# Altium project 724452_RPL-HX_Mobile_AEP_Rev0p91.PrjPcb (part 11 of 13)

## Sheet 0083_USB3.SchDoc
size 848 x 558 mm
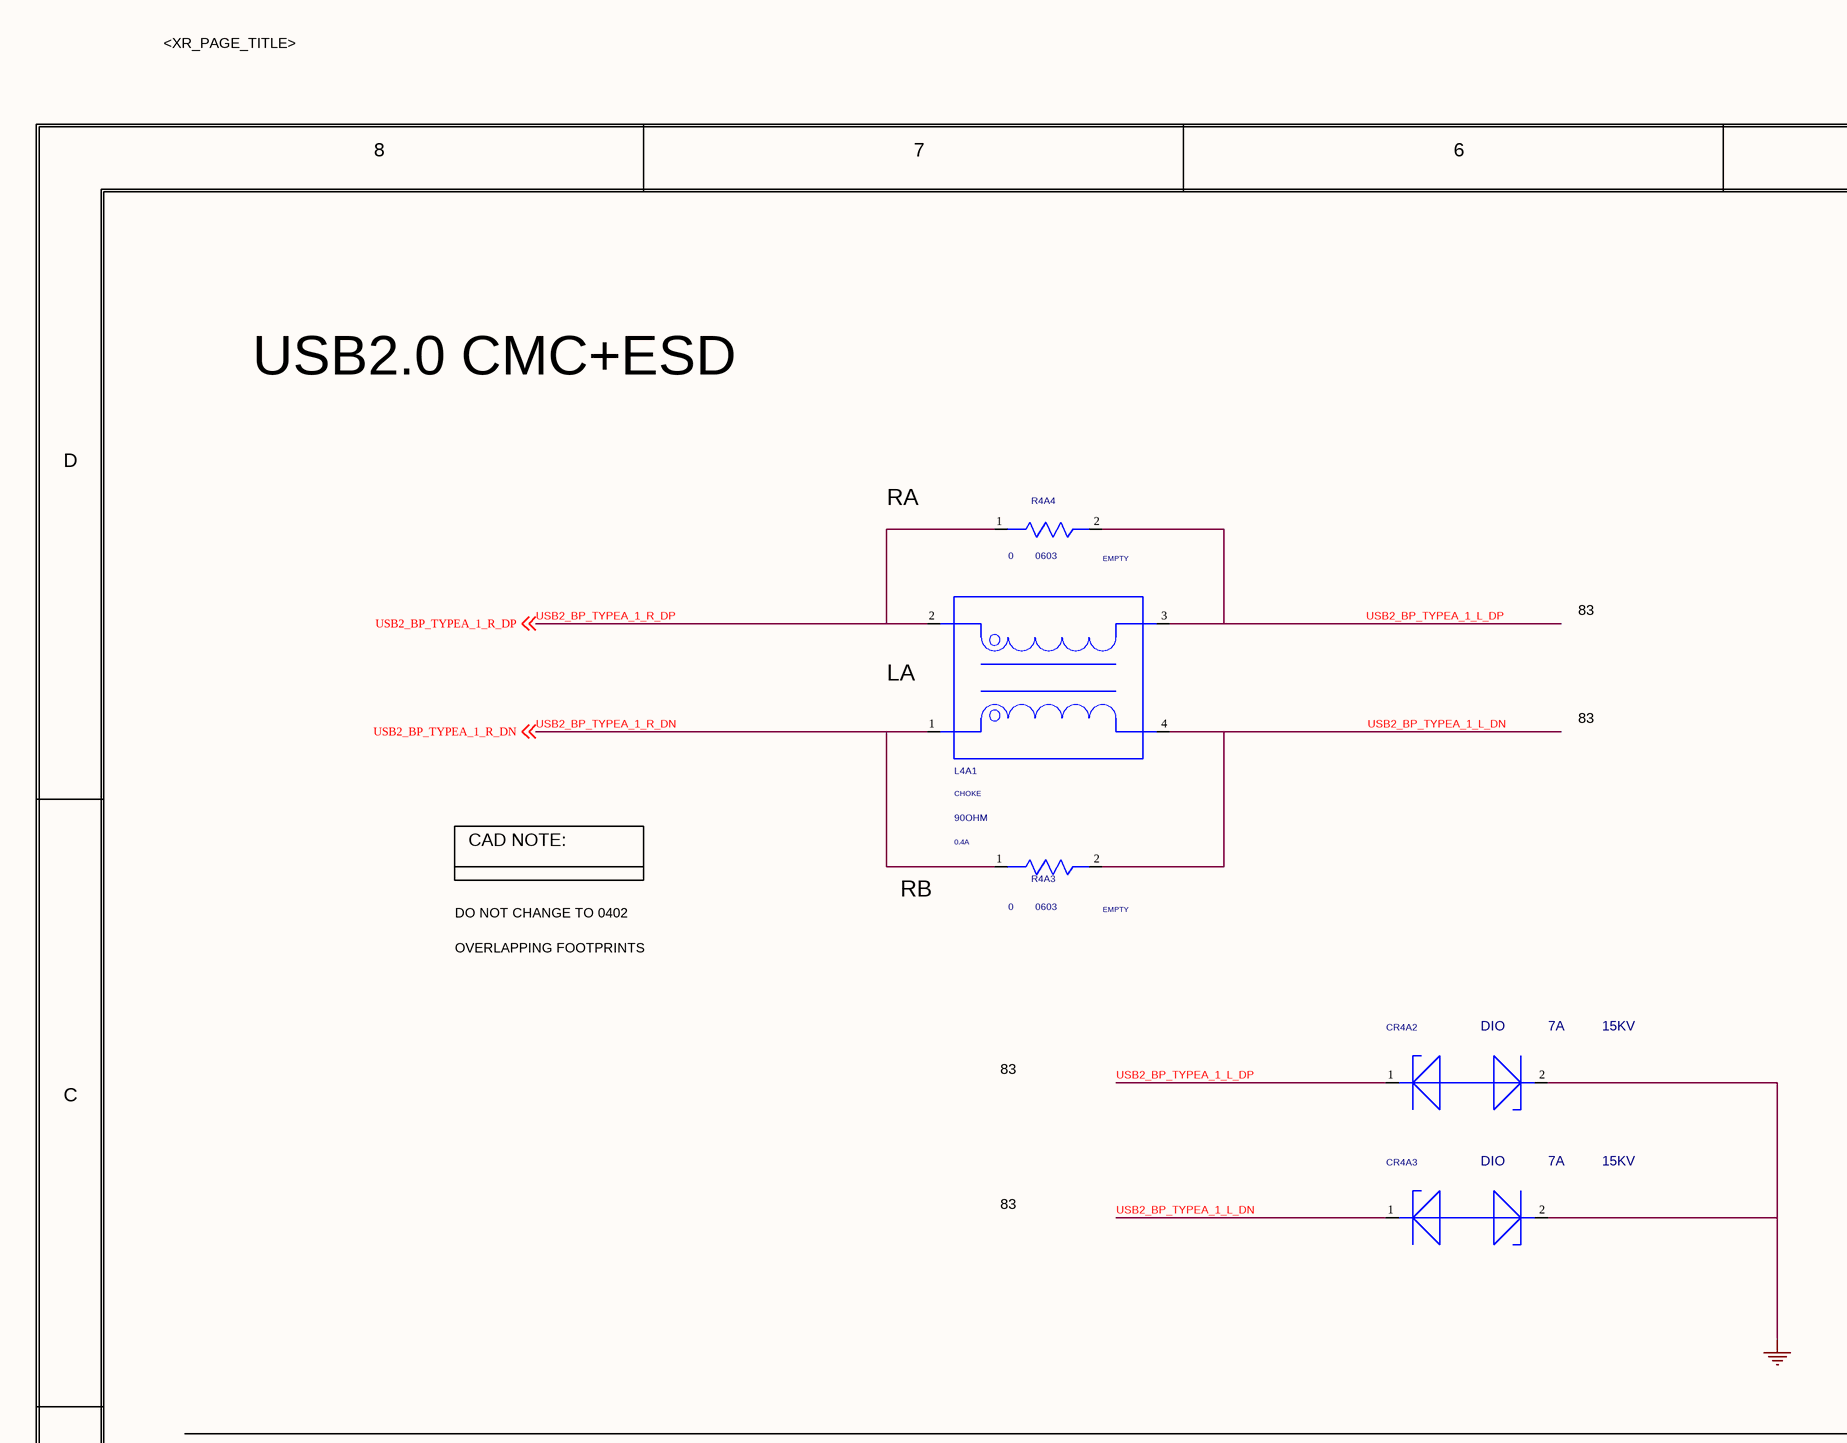
[diagram p136: 0083_USB3.SchDoc, top left]
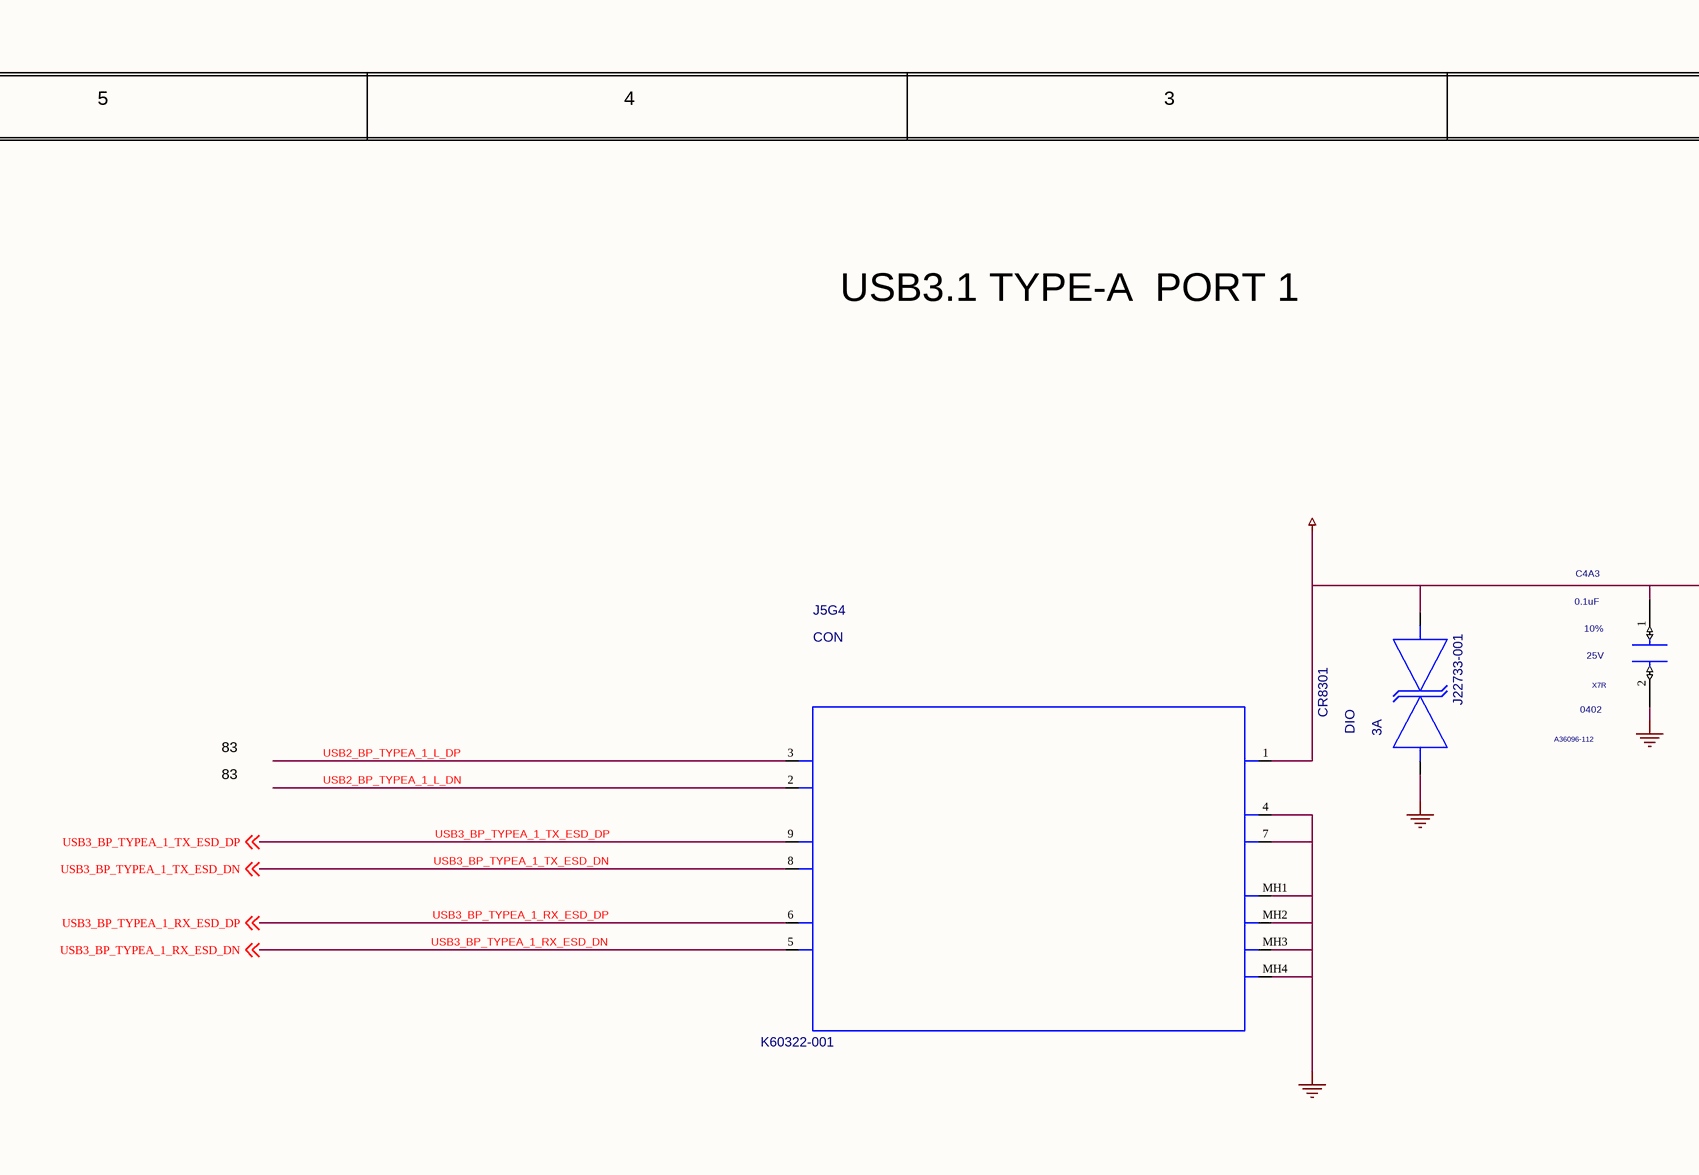
[diagram p137: 0083_USB3.SchDoc, top middle]
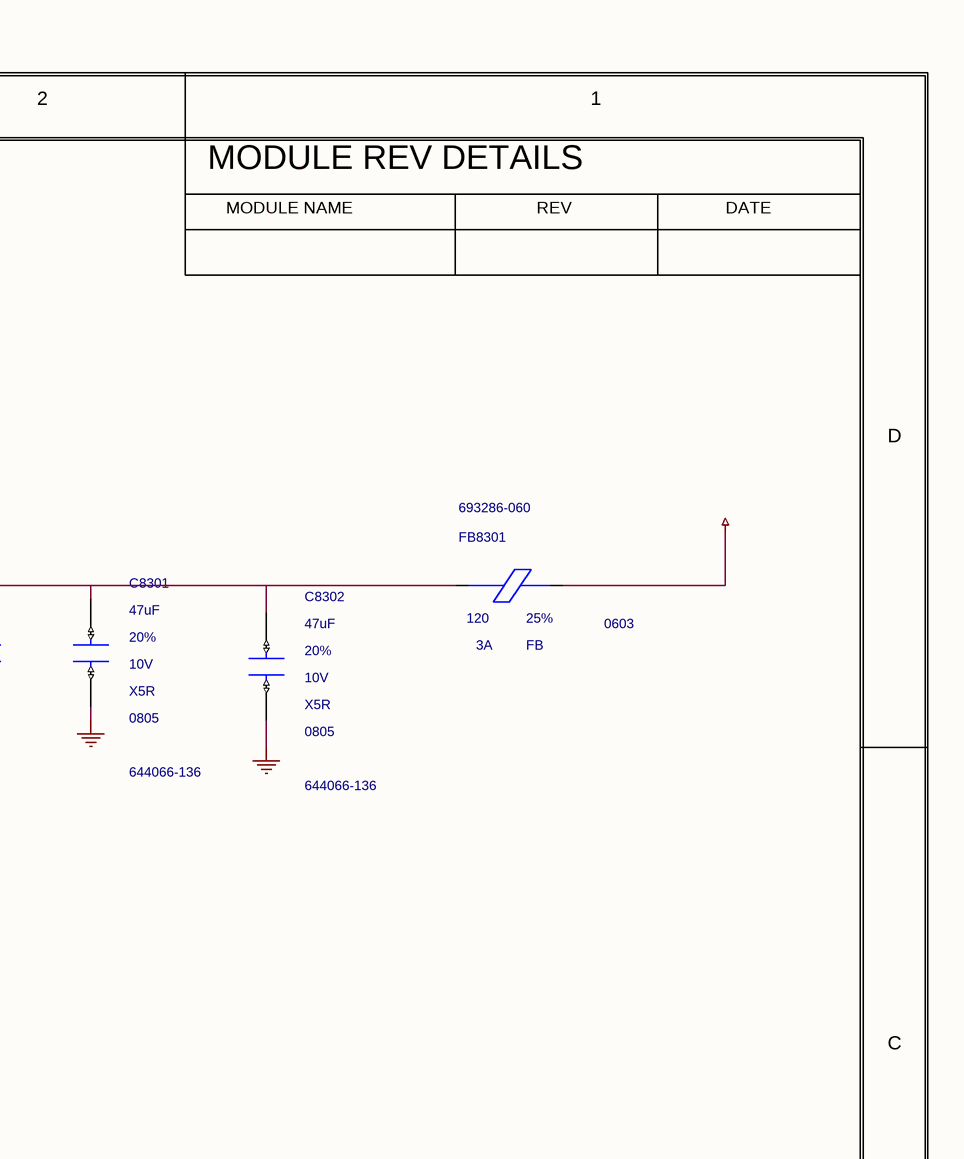
[diagram p138: 0083_USB3.SchDoc, top right]
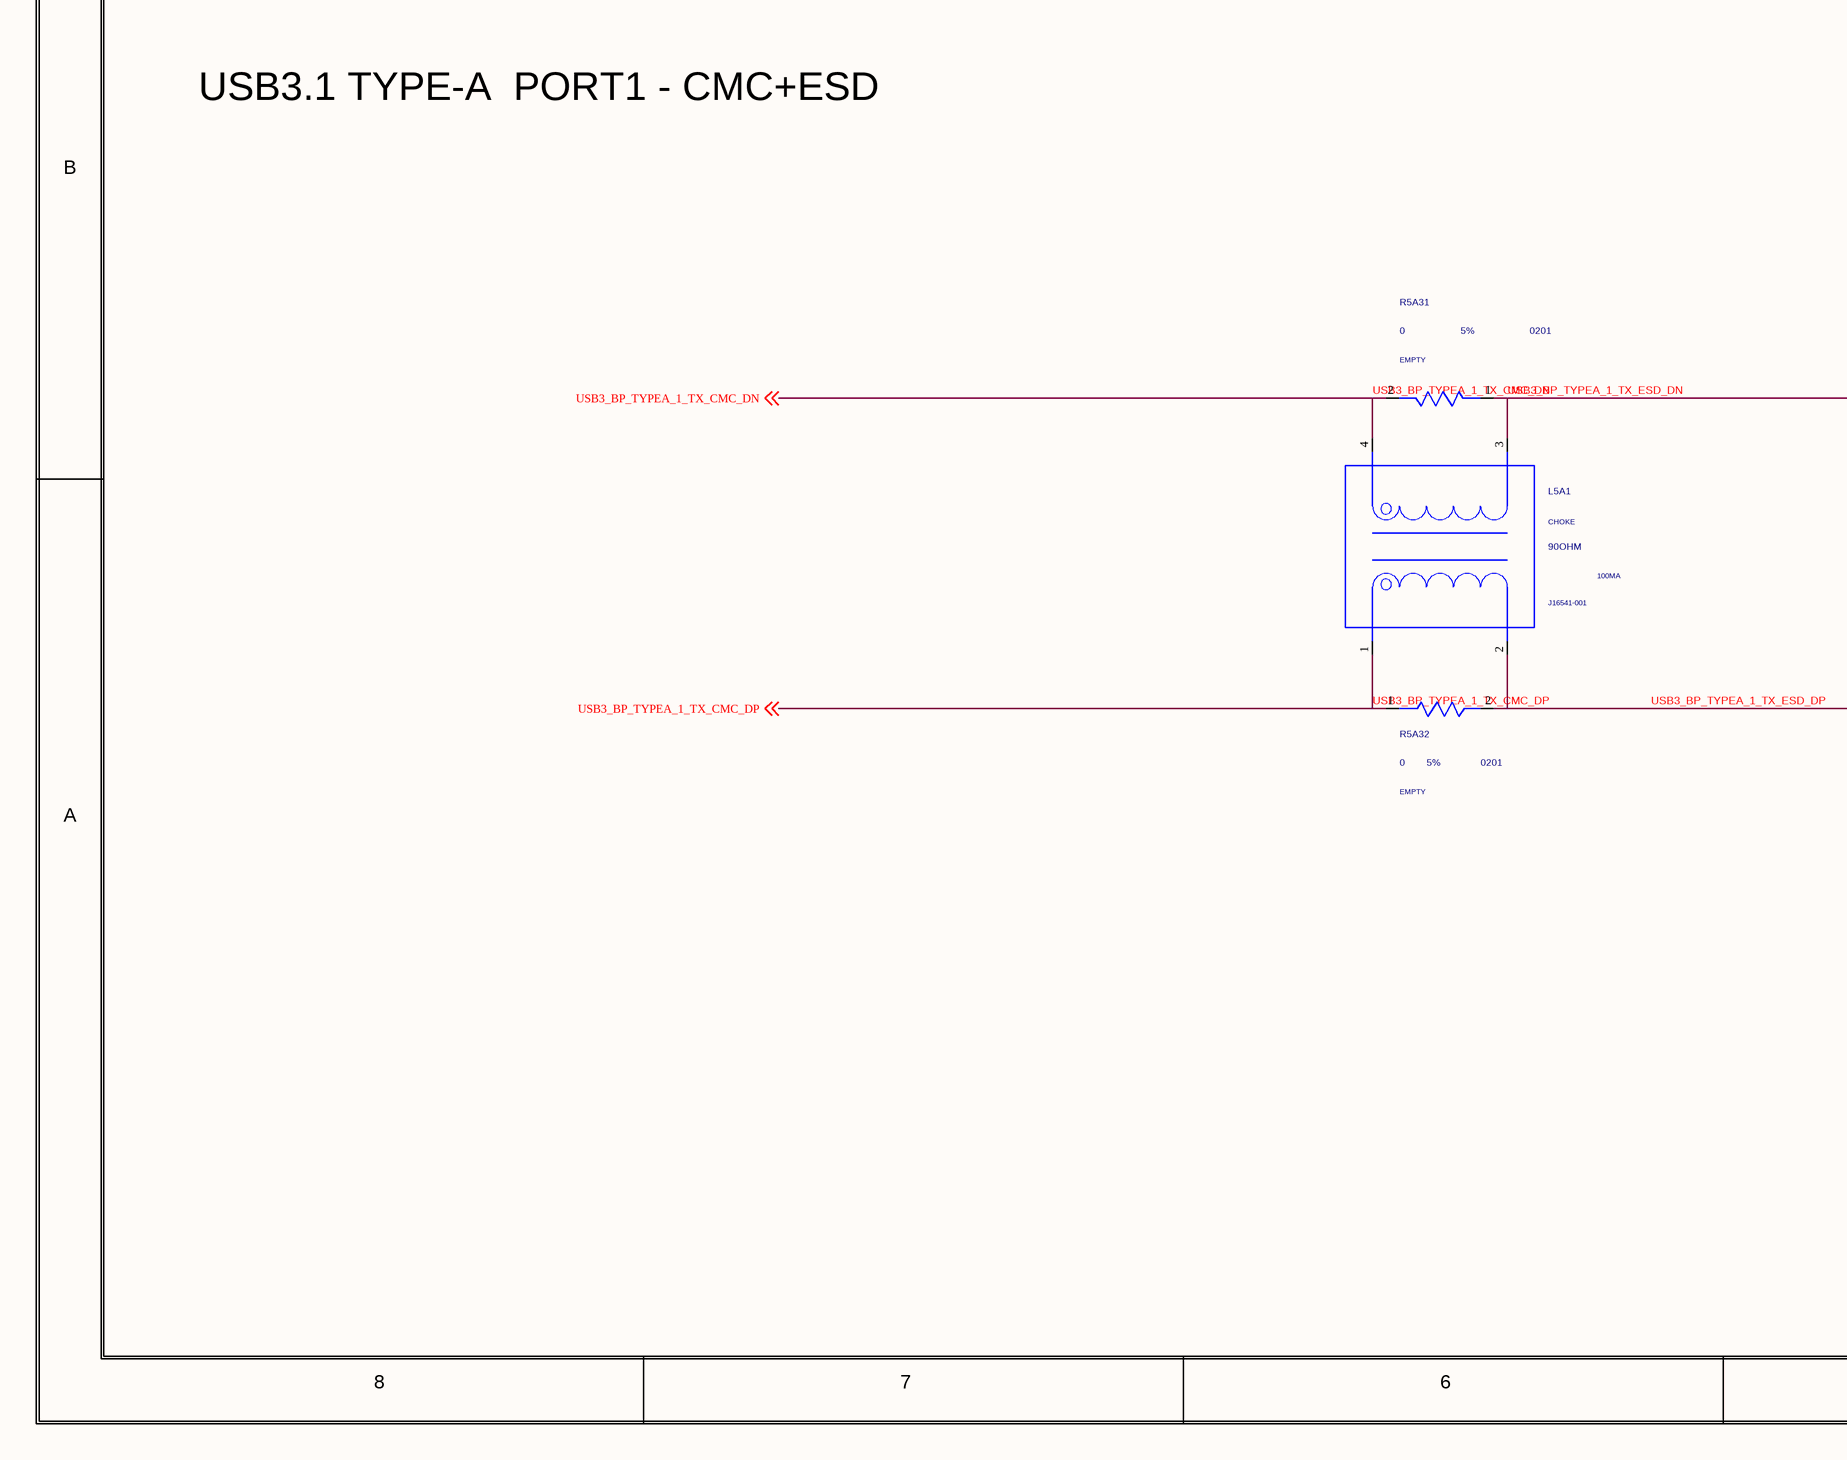
[diagram p139: 0083_USB3.SchDoc, bottom left]
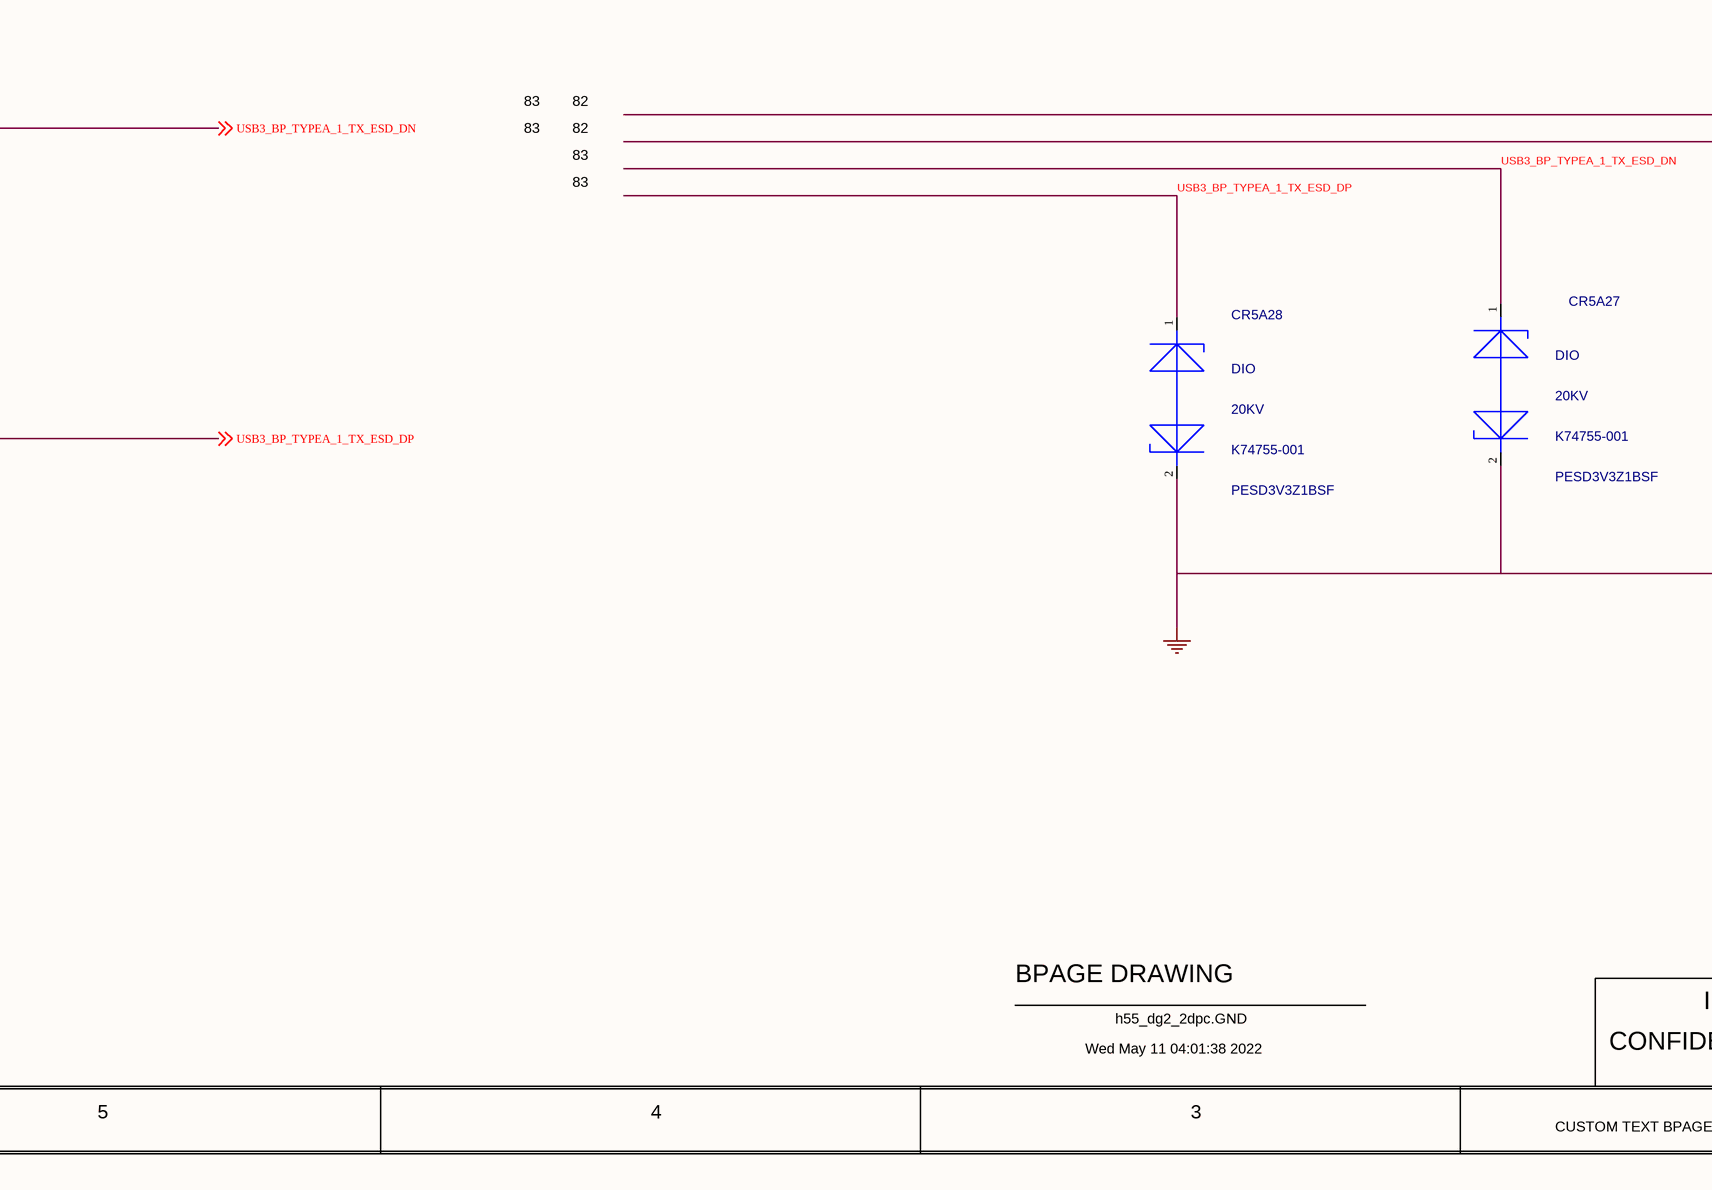
[diagram p140: 0083_USB3.SchDoc, bottom middle]
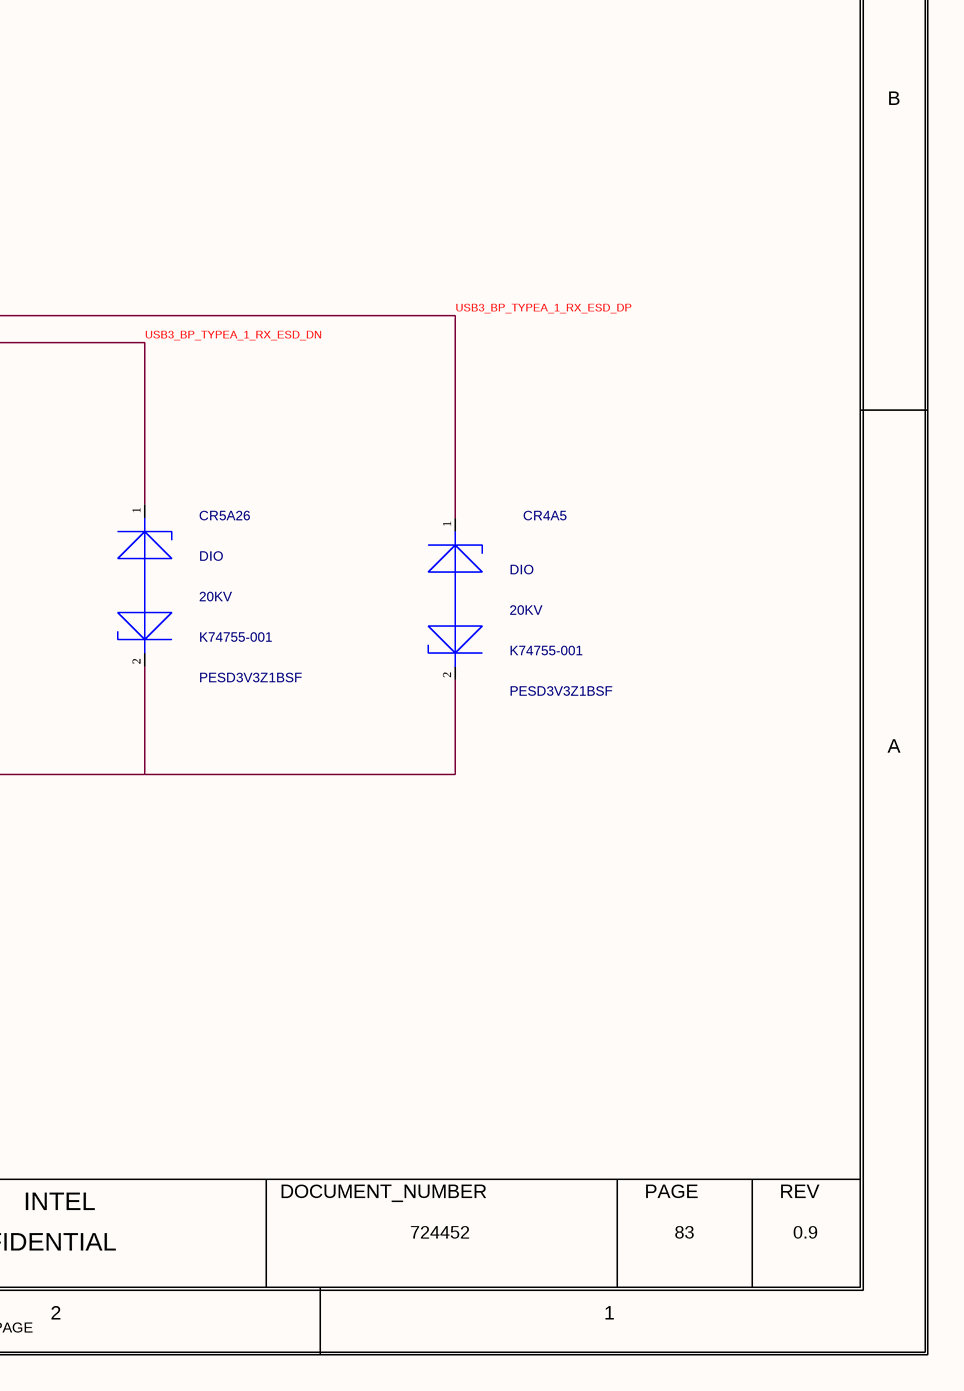
[diagram p141: 0083_USB3.SchDoc, bottom right]

### Parts
C4A3  0.1uF  MATERIAL: X7R  PACK_TYPE: 0402  PART_NUMBER: A36096-112  TOLERANCE: 10%  VOLTAGE: 25V  [SMC0402IA]
C8301  47uF  MATERIAL: X5R  PACK_TYPE: 0805  PART_NUMBER: 644066-136  TOLERANCE: 20%  VOLTAGE: 10V  [CTK2_SM0805_2200X1450_MA]
C8302  47uF  MATERIAL: X5R  PACK_TYPE: 0805  PART_NUMBER: 644066-136  TOLERANCE: 20%  VOLTAGE: 10V  [CTK2_SM0805_2200X1450_MA]
CR4A2  15KV  CURRENT: 7A  MATERIAL: DIO  [TK0_SOD962_600X300_MA]
CR4A3  15KV  CURRENT: 7A  MATERIAL: DIO  [TK0_SOD962_600X300_MA]
CR4A5  PESD3V3Z1BSF  CURRENT: 20KV  MATERIAL: DIO  PART_NUMBER: K74755-001  [TK0_SCR_625X325_MB]
CR5A26  PESD3V3Z1BSF  CURRENT: 20KV  MATERIAL: DIO  PART_NUMBER: K74755-001  [TK0_SCR_625X325_MB]
CR5A27  PESD3V3Z1BSF  CURRENT: 20KV  MATERIAL: DIO  PART_NUMBER: K74755-001  [TK0_SCR_625X325_MB]
CR5A28  PESD3V3Z1BSF  CURRENT: 20KV  MATERIAL: DIO  PART_NUMBER: K74755-001  [TK0_SCR_625X325_MB]
CR8301  CURRENT: 3A  MATERIAL: DIO  PART_NUMBER: J22733-001  [CTK2_SCR0201_610X310_MA]  (hidden comment: ESD200-B1-CSP0201)
FB8301  120  CURRENT: 3A  MATERIAL: FB  PACK_TYPE: 0603  PART_NUMBER: 693286-060  TOLERANCE: 25%  [CTK2_SM0603_1750X950_MA]
J5G4  MATERIAL: CON  PART_NUMBER: K60322-001  [CUSB3_MIDJR_9P_4EM_2000_MA_PIP_MR]  (hidden comment: C_USB3_TYPE_A_9P_4EM)
L4A1  90OHM  CURRENT: 0.4A  MATERIAL: CHOKE  [SMI4_79X47IA]
L5A1  90OHM  CURRENT: 100MA  MATERIAL: CHOKE  PART_NUMBER: J16541-001  [SMI4_50X65MA]
R4A3  0  MATERIAL: EMPTY  PACK_TYPE: 0603  [SMR0603IA]
R4A4  0  MATERIAL: EMPTY  PACK_TYPE: 0603  [SMR0603IA]
R5A31  0  MATERIAL: EMPTY  PACK_TYPE: 0201  TOLERANCE: 5%  [SMR0201IA]
R5A32  0  MATERIAL: EMPTY  PACK_TYPE: 0201  TOLERANCE: 5%  [SMR0201IA]

### Nets
+V5A_USB_P1: FB8301.2(B)
+V5A_USB_P1_FB: C4A3.1(A) C8301.1(A) C8302.1(A) CR8301.2(A2) FB8301.1(A) J5G4.1(VBUS_POWER)
GND: C4A3.2(B) C8301.2(B) C8302.2(B) CR4A2.2(K2) CR4A3.2(K2) CR4A5.2(K2) CR5A26.2(K2) CR5A27.2(K2) CR5A28.2(K2) CR8301.1(A1) J5G4.4(GND_POWER_RETURN) J5G4.7(GND) J5G4.MH1 J5G4.MH2 J5G4.MH3 J5G4.MH4  [project net EXP_A_RX_4_DP]
USB2_BP_TYPEA_1_L_DN: CR4A3.1(K1) J5G4.2(D_DN) L4A1.4(OUT_1) R4A3.2(B)
USB2_BP_TYPEA_1_L_DP: CR4A2.1(K1) J5G4.3(D_DP) L4A1.3(IN_2) R4A4.2(B)
USB2_BP_TYPEA_1_R_DN: L4A1.1(IN_1) R4A3.1(A) ; off-sheet USB2_BP_TYPEA_1_R_DN
USB2_BP_TYPEA_1_R_DP: L4A1.2(OUT_2) R4A4.1(A) ; off-sheet USB2_BP_TYPEA_1_R_DP
USB3_BP_TYPEA_1_RX_ESD_DN: CR5A26.1(K1) J5G4.5(SSRX_DN) ; off-sheet USB3_BP_TYPEA_1_RX_ESD_DN
USB3_BP_TYPEA_1_RX_ESD_DP: CR4A5.1(K1) J5G4.6(SSRX_DP) ; off-sheet USB3_BP_TYPEA_1_RX_ESD_DP
USB3_BP_TYPEA_1_TX_CMC_DN: L5A1.4(PIN4) R5A31.2(B) ; off-sheet USB3_BP_TYPEA_1_TX_CMC_DN
USB3_BP_TYPEA_1_TX_CMC_DP: L5A1.1(PIN1) R5A32.1(A) ; off-sheet USB3_BP_TYPEA_1_TX_CMC_DP
USB3_BP_TYPEA_1_TX_ESD_DN: CR5A27.1(K1) J5G4.8(SSTX_DN) L5A1.3(PIN3) R5A31.1(A) ; off-sheet USB3_BP_TYPEA_1_TX_ESD_DN
USB3_BP_TYPEA_1_TX_ESD_DP: CR5A28.1(K1) J5G4.9(SSTX_DP) L5A1.2(PIN2) R5A32.2(B) ; off-sheet USB3_BP_TYPEA_1_TX_ESD_DP

### Notes on the sheet
- <XR_PAGE_TITLE>
- 8
- 7
- 6
- 5
- 4
- 3
- 2
- 1
- MODULE REV DETAILS
- MODULE NAME
- REV
- DATE
- USB2.0 CMC+ESD
- USB3.1 TYPE-A  PORT 1
- D
- RA
- 83
- (near L4A1) LA
- CAD NOTE:
- DO NOT CHANGE TO 0402
- RB
- OVERLAPPING FOOTPRINTS
- C
- USB3.1 TYPE-A  PORT1 - CMC+ESD
- B
- 82
- A
- BPAGE DRAWING
- INTEL
- DOCUMENT_NUMBER
- PAGE
- Wed May 11 04:01:38 2022
- h55_dg2_2dpc.GND
- CONFIDENTIAL
- 724452
- 0.9
- CUSTOM TEXT BPAGE

### Library data of the parts
C4A3 = CAP: CDS_PHYS_PART_NAME: CAP_0402-A36096-112,X7R,0.1UF,25V,10%,LPDB,GENERIC; OriginalSymbolOrigin: (-50,25); XY: (-1625,4050); VER: 1; ROT: 2; PHYS_PAGE: 83; LOCATION: C4A3; IP: GENERIC; FP_TECH: LPDB; DRAWING: @RVP1_ADL_SB_ADP_S_DDR5_SODIMM_2DPC_LIB.H55_DG2_2DPC(SCH_1):PAGE455; CDS_LIB: discrete; PCB Footprint: SMC0402IA; CHIPS_PART_NAME: CAP; CDS_PART_NAME: CAP_0402-A36096-112,X7R,0.1UF,25V,10%,LPDB,GENERIC; CDS_LOCATION: C4A3; ASI_MODEL: A36096-112
C8301 = C_CAP: CDS_PHYS_PART_NAME: C_CAP_0805-644066-136,X5R,47UF,10V,20%,TK2,GENERIC; CDS_LMAN_SYM_OUTLINE: -50,50,50,-50; FP_TECH: TK2; IP: GENERIC; ROOM: NONE; OriginalSymbolOrigin: (-50,25); XY: (-1425,4050); VER: 1; ROT: 0; PHYS_PAGE: 83; LOCATION: C8301; DRAWING: @RVP1_ADL_SB_ADP_S_DDR5_SODIMM_2DPC_LIB.H55_DG2_2DPC(SCH_1):PAGE455; CDS_LIB: c_discrete; VARIANT: ?; PCB Footprint: CTK2_SM0805_2200X1450_MA; CHIPS_PART_NAME: C_CAP; CDS_PART_NAME: C_CAP_0805-644066-136,X5R,47UF,10V,20%,TK2,GENERIC; CDS_LOCATION: C8301
C8302 = C_CAP: CDS_PHYS_PART_NAME: C_CAP_0805-644066-136,X5R,47UF,10V,20%,TK2,GENERIC; CDS_LMAN_SYM_OUTLINE: -50,50,50,-50; FP_TECH: TK2; IP: GENERIC; ROOM: NONE; OriginalSymbolOrigin: (-50,25); XY: (-1100,4025); VER: 1; ROT: 0; PHYS_PAGE: 83; LOCATION: C8302; DRAWING: @RVP1_ADL_SB_ADP_S_DDR5_SODIMM_2DPC_LIB.H55_DG2_2DPC(SCH_1):PAGE455; CDS_LIB: c_discrete; VARIANT: ?; PCB Footprint: CTK2_SM0805_2200X1450_MA; CHIPS_PART_NAME: C_CAP; CDS_PART_NAME: C_CAP_0805-644066-136,X5R,47UF,10V,20%,TK2,GENERIC; CDS_LOCATION: C8302
CR4A2 = DIODE_ESD_BIDIR_2: PART_NUMBER: J24007-001; CDS_PHYS_PART_NAME: DIODE_ESD_BIDIR_2_SOD962-J24007-001,DIO,15KV,7A,TK0,GENERIC; BOM_USE: STUFF; CDS_LMAN_SYM_OUTLINE: -150,150,150,-150; FP_TECH: TK0; IP: GENERIC; PACK_TYPE: SOD962; ROOM: NONE; OriginalSymbolOrigin: (-125,50); XY: (-5475,3350); VER: 1; ROT: 0; PHYS_PAGE: 83; LOCATION: CR4A2; DRAWING: @RVP1_ADL_SB_ADP_S_DDR5_SODIMM_2DPC_LIB.H55_DG2_2DPC(SCH_1):PAGE455; CDS_LIB: discrete_2; VARIANT: ?; PCB Footprint: TK0_SOD962_600X300_MA; CHIPS_PART_NAME: DIODE_ESD_BIDIR_2; CDS_PART_NAME: DIODE_ESD_BIDIR_2_SOD962-J24007-001,DIO,15KV,7A,TK0,GENERIC; CDS_LOCATION: CR4A2; ASI_MODEL: J24007-001
CR4A3 = DIODE_ESD_BIDIR_2: PART_NUMBER: J24007-001; CDS_PHYS_PART_NAME: DIODE_ESD_BIDIR_2_SOD962-J24007-001,DIO,15KV,7A,TK0,GENERIC; BOM_USE: STUFF; CDS_LMAN_SYM_OUTLINE: -150,150,150,-150; FP_TECH: TK0; IP: GENERIC; PACK_TYPE: SOD962; ROOM: NONE; OriginalSymbolOrigin: (-125,50); XY: (-5475,3100); VER: 1; ROT: 0; PHYS_PAGE: 83; LOCATION: CR4A3; DRAWING: @RVP1_ADL_SB_ADP_S_DDR5_SODIMM_2DPC_LIB.H55_DG2_2DPC(SCH_1):PAGE455; CDS_LIB: discrete_2; VARIANT: ?; PCB Footprint: TK0_SOD962_600X300_MA; CHIPS_PART_NAME: DIODE_ESD_BIDIR_2; CDS_PART_NAME: DIODE_ESD_BIDIR_2_SOD962-J24007-001,DIO,15KV,7A,TK0,GENERIC; CDS_LOCATION: CR4A3; ASI_MODEL: J24007-001
CR4A5 = DIODE_ESD_BIDIR_2: CDS_PHYS_PART_NAME: DIODE_ESD_BIDIR_2_SOD962-K74755-001,DIO,PESD3V3Z1BSF,20KV,TK0,GA; BOM_USE: STUFF; CDS_LMAN_SYM_OUTLINE: -150,150,150,-150; FP_TECH: TK0; IP: GENERIC; PACK_TYPE: SOD962; ROOM: NONE; OriginalSymbolOrigin: (-125,50); XY: (-750,1275); VER: 1; ROT: 5; PHYS_PAGE: 83; LOCATION: CR4A5; DRAWING: @RVP1_ADL_SB_ADP_S_DDR5_SODIMM_2DPC_LIB.H55_DG2_2DPC(SCH_1):PAGE455; CDS_LIB: discrete_2; VARIANT: ?; PCB Footprint: TK0_SCR_625X325_MB; CHIPS_PART_NAME: DIODE_ESD_BIDIR_2; CDS_PART_NAME: DIODE_ESD_BIDIR_2_SOD962-K74755-001,DIO,PESD3V3Z1BSF,20KV,TK0,GA; CDS_LOCATION: CR4A5
CR5A26 = DIODE_ESD_BIDIR_2: CDS_PHYS_PART_NAME: DIODE_ESD_BIDIR_2_SOD962-K74755-001,DIO,PESD3V3Z1BSF,20KV,TK0,GA; BOM_USE: STUFF; CDS_LMAN_SYM_OUTLINE: -150,150,150,-150; FP_TECH: TK0; IP: GENERIC; PACK_TYPE: SOD962; ROOM: NONE; OriginalSymbolOrigin: (-125,50); XY: (-1325,1300); VER: 1; ROT: 5; PHYS_PAGE: 83; LOCATION: CR5A26; DRAWING: @RVP1_ADL_SB_ADP_S_DDR5_SODIMM_2DPC_LIB.H55_DG2_2DPC(SCH_1):PAGE455; CDS_LIB: discrete_2; VARIANT: ?; PCB Footprint: TK0_SCR_625X325_MB; CHIPS_PART_NAME: DIODE_ESD_BIDIR_2; CDS_PART_NAME: DIODE_ESD_BIDIR_2_SOD962-K74755-001,DIO,PESD3V3Z1BSF,20KV,TK0,GA; CDS_LOCATION: CR5A26
CR5A27 = DIODE_ESD_BIDIR_2: CDS_PHYS_PART_NAME: DIODE_ESD_BIDIR_2_SOD962-K74755-001,DIO,PESD3V3Z1BSF,20KV,TK0,GA; BOM_USE: STUFF; CDS_LMAN_SYM_OUTLINE: -150,150,150,-150; FP_TECH: TK0; IP: GENERIC; PACK_TYPE: SOD962; ROOM: NONE; OriginalSymbolOrigin: (-125,50); XY: (-1925,1300); VER: 1; ROT: 5; PHYS_PAGE: 83; LOCATION: CR5A27; DRAWING: @RVP1_ADL_SB_ADP_S_DDR5_SODIMM_2DPC_LIB.H55_DG2_2DPC(SCH_1):PAGE455; CDS_LIB: discrete_2; VARIANT: ?; PCB Footprint: TK0_SCR_625X325_MB; CHIPS_PART_NAME: DIODE_ESD_BIDIR_2; CDS_PART_NAME: DIODE_ESD_BIDIR_2_SOD962-K74755-001,DIO,PESD3V3Z1BSF,20KV,TK0,GA; CDS_LOCATION: CR5A27
CR5A28 = DIODE_ESD_BIDIR_2: CDS_PHYS_PART_NAME: DIODE_ESD_BIDIR_2_SOD962-K74755-001,DIO,PESD3V3Z1BSF,20KV,TK0,GA; BOM_USE: STUFF; CDS_LMAN_SYM_OUTLINE: -150,150,150,-150; FP_TECH: TK0; IP: GENERIC; PACK_TYPE: SOD962; ROOM: NONE; OriginalSymbolOrigin: (-125,50); XY: (-2525,1275); VER: 1; ROT: 5; PHYS_PAGE: 83; LOCATION: CR5A28; DRAWING: @RVP1_ADL_SB_ADP_S_DDR5_SODIMM_2DPC_LIB.H55_DG2_2DPC(SCH_1):PAGE455; CDS_LIB: discrete_2; VARIANT: ?; PCB Footprint: TK0_SCR_625X325_MB; CHIPS_PART_NAME: DIODE_ESD_BIDIR_2; CDS_PART_NAME: DIODE_ESD_BIDIR_2_SOD962-K74755-001,DIO,PESD3V3Z1BSF,20KV,TK0,GA; CDS_LOCATION: CR5A28
CR8301 = C_DIODE_TVS: CDS_PHYS_PART_NAME: C_DIODE_TVS_SM-J22733-001,DIO,ESD200-B1-CSP0201,3A,TK2,GENERIC; CDS_LMAN_SYM_OUTLINE: -100,50,100,-50; FP_TECH: TK2; IP: GENERIC; PACK_TYPE: SM; ROOM: NONE; OriginalSymbolOrigin: (-125,50); XY: (-2050,3975); VER: 1; PHYS_PAGE: 83; LOCATION: CR8301; DRAWING: @RVP1_ADL_SB_ADP_S_DDR5_SODIMM_2DPC_LIB.H55_DG2_2DPC(SCH_1):PAGE455; CDS_LIB: local; VARIANT: ?; PCB Footprint: CTK2_SCR0201_610X310_MA; ROT: 1; CHIPS_PART_NAME: C_DIODE_TVS; CDS_PART_NAME: C_DIODE_TVS_SM-J22733-001,DIO,ESD200-B1-CSP0201,3A,TK2,GENERIC; CDS_LOCATION: CR8301
FB8301 = C_FERRITE: CDS_PHYS_PART_NAME: C_FERRITE_0603-693286-060,FB,120,25%,3A,TK2,GENERIC; CDS_LMAN_SYM_OUTLINE: -50,50,50,-50; FP_TECH: TK2; IP: GENERIC; ROOM: NONE; OriginalSymbolOrigin: (-75,50); XY: (-650,4175); VER: 1; ROT: 0; PHYS_PAGE: 83; LOCATION: FB8301; DRAWING: @RVP1_ADL_SB_ADP_S_DDR5_SODIMM_2DPC_LIB.H55_DG2_2DPC(SCH_1):PAGE455; CDS_LIB: c_discrete; VARIANT: ?; PCB Footprint: CTK2_SM0603_1750X950_MA; CHIPS_PART_NAME: C_FERRITE; CDS_PART_NAME: C_FERRITE_0603-693286-060,FB,120,25%,3A,TK2,GENERIC; CDS_LOCATION: FB8301
J5G4 = C_USB3_TYPE_A_9P_4EM: CDS_PHYS_PART_NAME: C_USB3_TYPE_A_9P_4EM_TH-K60322-001,CON,USB3P1_GEN2_9P_4EM,TK0,GA; CDS_LMAN_SYM_OUTLINE: -400,300,400,-300; FP_TECH: TK0; IP: GENERIC; PACK_TYPE: TH; ROOM: NONE; OriginalSymbolOrigin: (-425,300); XY: (-2775,3650); VER: 1; ROT: 0; PHYS_PAGE: 83; LOCATION: J5G4; DRAWING: @RVP1_ADL_SB_ADP_S_DDR5_SODIMM_2DPC_LIB.H55_DG2_2DPC(SCH_1):PAGE455; CDS_LIB: local; VARIANT: ?; PCB Footprint: CUSB3_MIDJR_9P_4EM_2000_MA_PIP_MR; SEC_TYPE: TH; CHIPS_PART_NAME: C_USB3_TYPE_A_9P_4EM; CDS_PART_NAME: C_USB3_TYPE_A_9P_4EM_TH-K60322-001,CON,USB3P1_GEN2_9P_4EM,TK0,GA; CDS_LOCATION: J5G4
L4A1 = IND_4PIN: PART_NUMBER: 752402-015; CDS_PHYS_PART_NAME: IND_4PIN_0805-752402-015,CHOKE,90OHM,NA,0.4A,LPDB,GENERIC; CDS_LMAN_SYM_OUTLINE: -200,150,150,-150; PACK_TYPE: 0805; TOLERANCE: NA; OriginalSymbolOrigin: (-225,150); XY: (-6225,4100); VER: 2; ROT: 6; PHYS_PAGE: 83; LOCATION: L4A1; IP: GENERIC; FP_TECH: LPDB; FIN: USB_BPR; DRAWING: @RVP1_ADL_SB_ADP_S_DDR5_SODIMM_2DPC_LIB.H55_DG2_2DPC(SCH_1):PAGE455; CDS_LIB: discrete; BOM: BP_USB_DUAL; PCB Footprint: SMI4_79X47IA; SEC_TYPE: 0805; CHIPS_PART_NAME: IND_4PIN; CDS_PART_NAME: IND_4PIN_0805-752402-015,CHOKE,90OHM,NA,0.4A,LPDB,GENERIC; CDS_LOCATION: L4A1; ASI_MODEL: 752402-015
L5A1 = CHOKE_4P: CDS_PHYS_PART_NAME: CHOKE_4P_SM3-J16541-001,CHOKE,90OHM,NA,100MA,LPDB,GENERIC; CDS_LMAN_SYM_OUTLINE: -150,200,150,-150; PACK_TYPE: SM3; TOLERANCE: NA; OriginalSymbolOrigin: (-175,200); XY: (-5550,1500); VER: 10; ROT: 7; PHYS_PAGE: 83; LOCATION: L5A1; IP: GENERIC; FP_TECH: LPDB; DRAWING: @RVP1_ADL_SB_ADP_S_DDR5_SODIMM_2DPC_LIB.H55_DG2_2DPC(SCH_1):PAGE455; CDS_LIB: discrete; PCB Footprint: SMI4_50X65MA; SEC_TYPE: SM3; CHIPS_PART_NAME: CHOKE_4P; CDS_PART_NAME: CHOKE_4P_SM3-J16541-001,CHOKE,90OHM,NA,100MA,LPDB,GENERIC; CDS_LOCATION: L5A1; ASI_MODEL: J16541-001
R4A3 = RES#1: PART_NUMBER: A93552-004; CHIPS_PART_NAME: RES; CDS_PHYS_PART_NAME: RES_0603-A93552-004,EMPTY,0,5%,1/10W,LPDB,GENERIC; TOLERANCE: 5%; WATTAGE: 1/10W; OriginalSymbolOrigin: (-75,25); XY: (-6250,3750); VER: 1; PHYS_PAGE: 83; LOCATION: R4A3; IP: GENERIC; FP_TECH: LPDB; FIN: USB_BPR; DRAWING: @RVP1_ADL_SB_ADP_S_DDR5_SODIMM_2DPC_LIB.H55_DG2_2DPC(SCH_1):PAGE455; CDS_LIB: discrete; BOM: BP_USB_DUAL; PCB Footprint: SMR0603IA; ROT: 0; CDS_PART_NAME: RES_0603-A93552-004,EMPTY,0,5%,1/10W,LPDB,GENERIC; CDS_LOCATION: R4A3; ASI_MODEL: A93552-004
R4A4 = RES#1: PART_NUMBER: A93552-004; CHIPS_PART_NAME: RES; CDS_PHYS_PART_NAME: RES_0603-A93552-004,EMPTY,0,5%,1/10W,LPDB,GENERIC; TOLERANCE: 5%; WATTAGE: 1/10W; OriginalSymbolOrigin: (-75,25); XY: (-6250,4375); VER: 1; PHYS_PAGE: 83; LOCATION: R4A4; IP: GENERIC; FP_TECH: LPDB; FIN: USB_BPR; DRAWING: @RVP1_ADL_SB_ADP_S_DDR5_SODIMM_2DPC_LIB.H55_DG2_2DPC(SCH_1):PAGE455; CDS_LIB: discrete; BOM: BP_USB_DUAL; PCB Footprint: SMR0603IA; ROT: 0; CDS_PART_NAME: RES_0603-A93552-004,EMPTY,0,5%,1/10W,LPDB,GENERIC; CDS_LOCATION: R4A4; ASI_MODEL: A93552-004
R5A31 = RES#1: PART_NUMBER: C80792-009; CHIPS_PART_NAME: RES; CDS_PHYS_PART_NAME: RES_0201-C80792-009,EMPTY,0,5%,1/20W,LPDB,GENERIC; WATTAGE: 1/20W; OriginalSymbolOrigin: (-75,25); XY: (-5525,1775); VER: 1; ROT: 2; PHYS_PAGE: 83; LOCATION: R5A31; IP: GENERIC; FP_TECH: LPDB; FIN: USB_BPR; DRAWING: @RVP1_ADL_SB_ADP_S_DDR5_SODIMM_2DPC_LIB.H55_DG2_2DPC(SCH_1):PAGE455; CDS_LIB: discrete; PCB Footprint: SMR0201IA; CDS_PART_NAME: RES_0201-C80792-009,EMPTY,0,5%,1/20W,LPDB,GENERIC; CDS_LOCATION: R5A31; ASI_MODEL: C80792-009
R5A32 = RES#1: PART_NUMBER: C80792-009; CHIPS_PART_NAME: RES; CDS_PHYS_PART_NAME: RES_0201-C80792-009,EMPTY,0,5%,1/20W,LPDB,GENERIC; WATTAGE: 1/20W; OriginalSymbolOrigin: (-75,25); XY: (-5525,1200); VER: 1; PHYS_PAGE: 83; LOCATION: R5A32; IP: GENERIC; FP_TECH: LPDB; FIN: USB_BPR; DRAWING: @RVP1_ADL_SB_ADP_S_DDR5_SODIMM_2DPC_LIB.H55_DG2_2DPC(SCH_1):PAGE455; CDS_LIB: discrete; PCB Footprint: SMR0201IA; ROT: 0; CDS_PART_NAME: RES_0201-C80792-009,EMPTY,0,5%,1/20W,LPDB,GENERIC; CDS_LOCATION: R5A32; ASI_MODEL: C80792-009

## Sheet 0084_USB3.SchDoc
size 848 x 558 mm
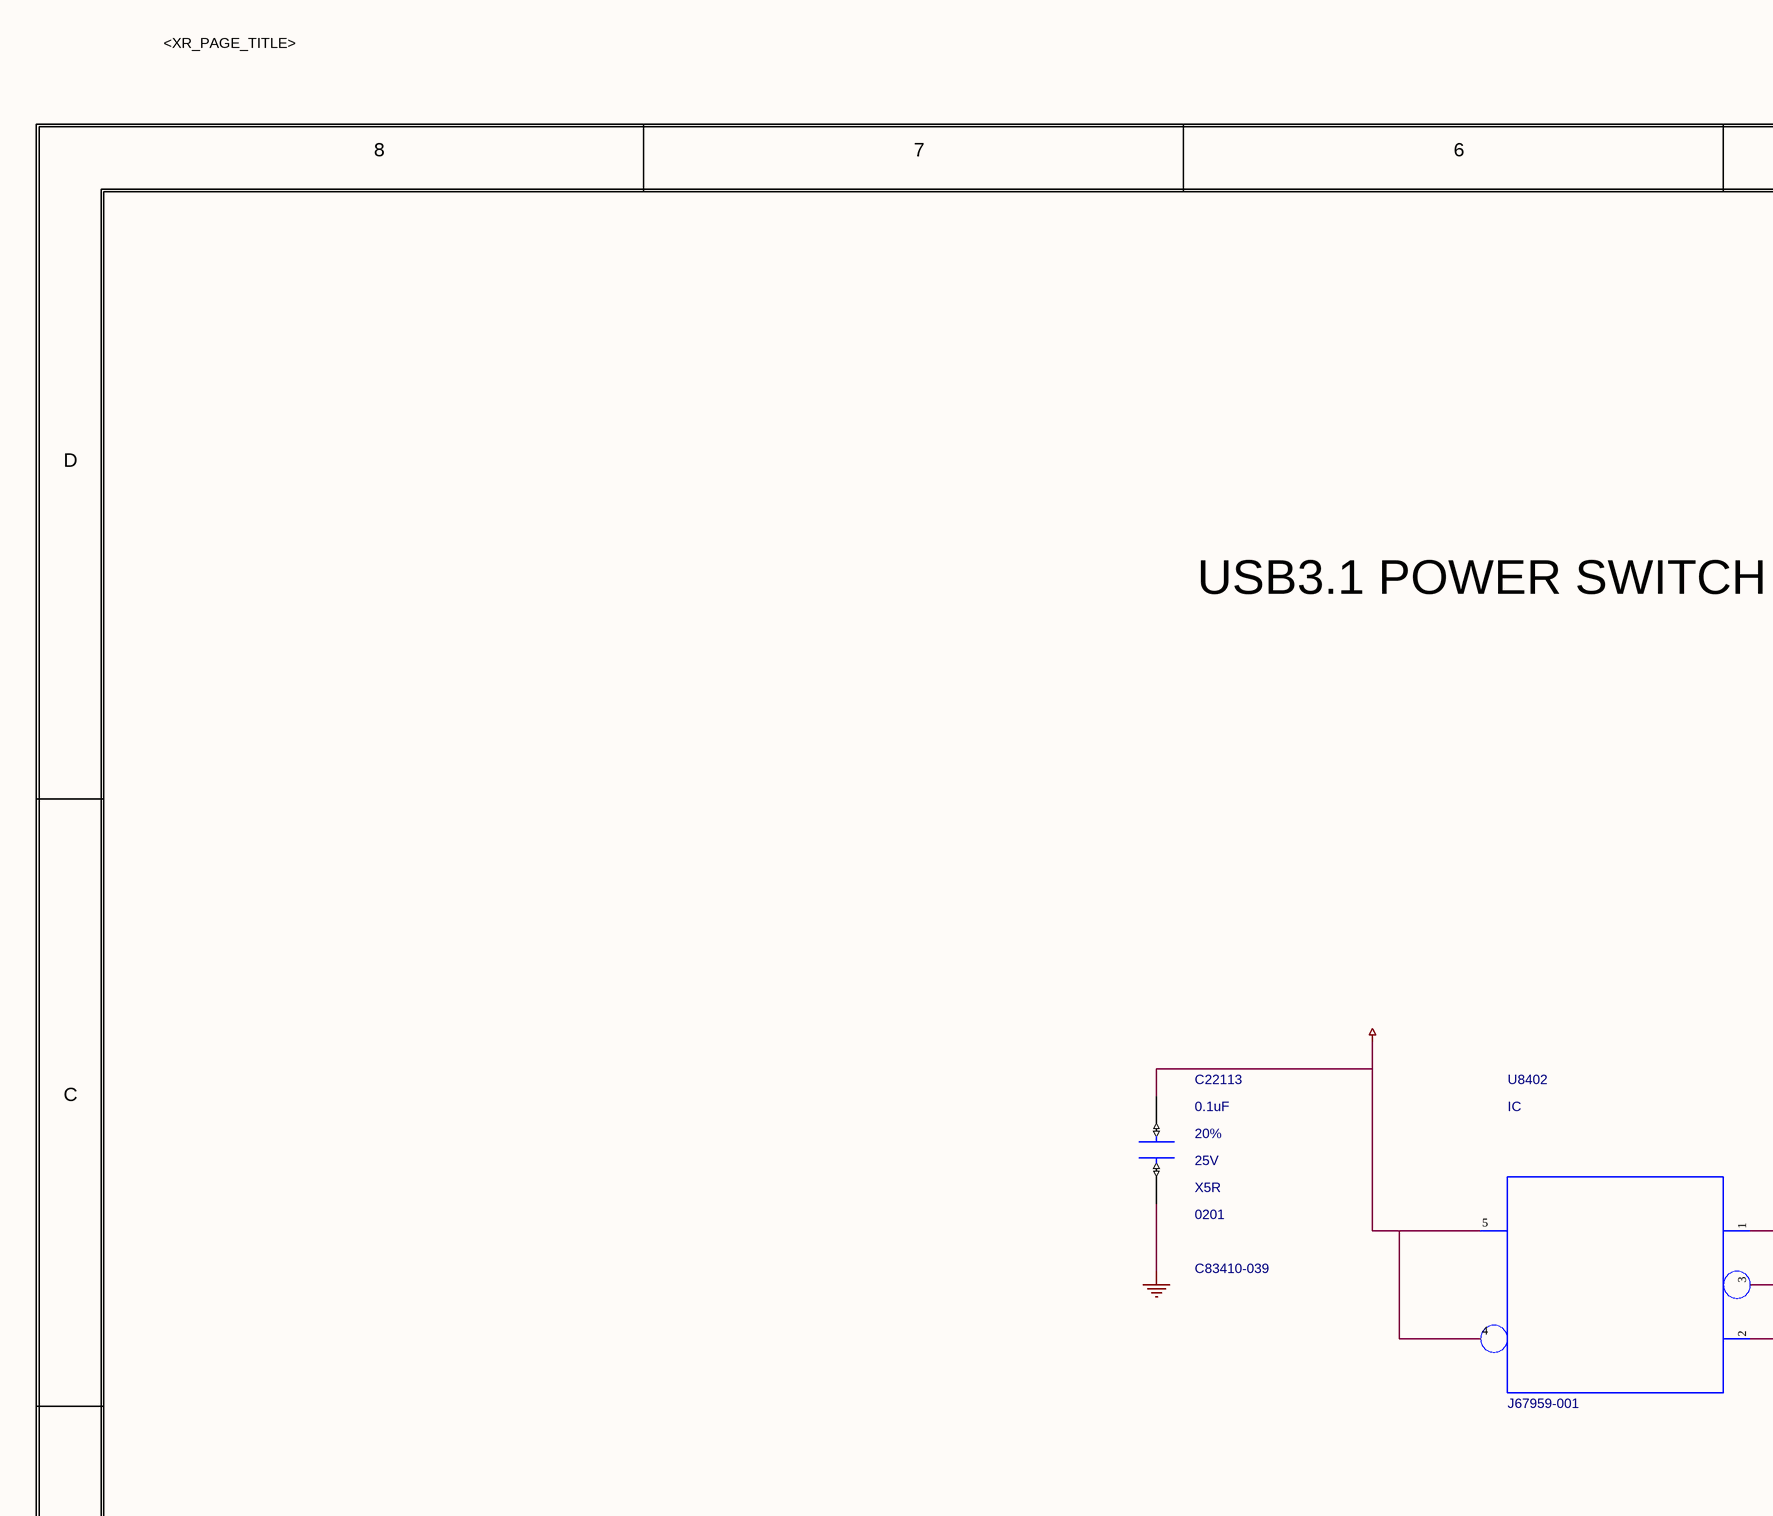
[diagram p142: 0084_USB3.SchDoc, top left]
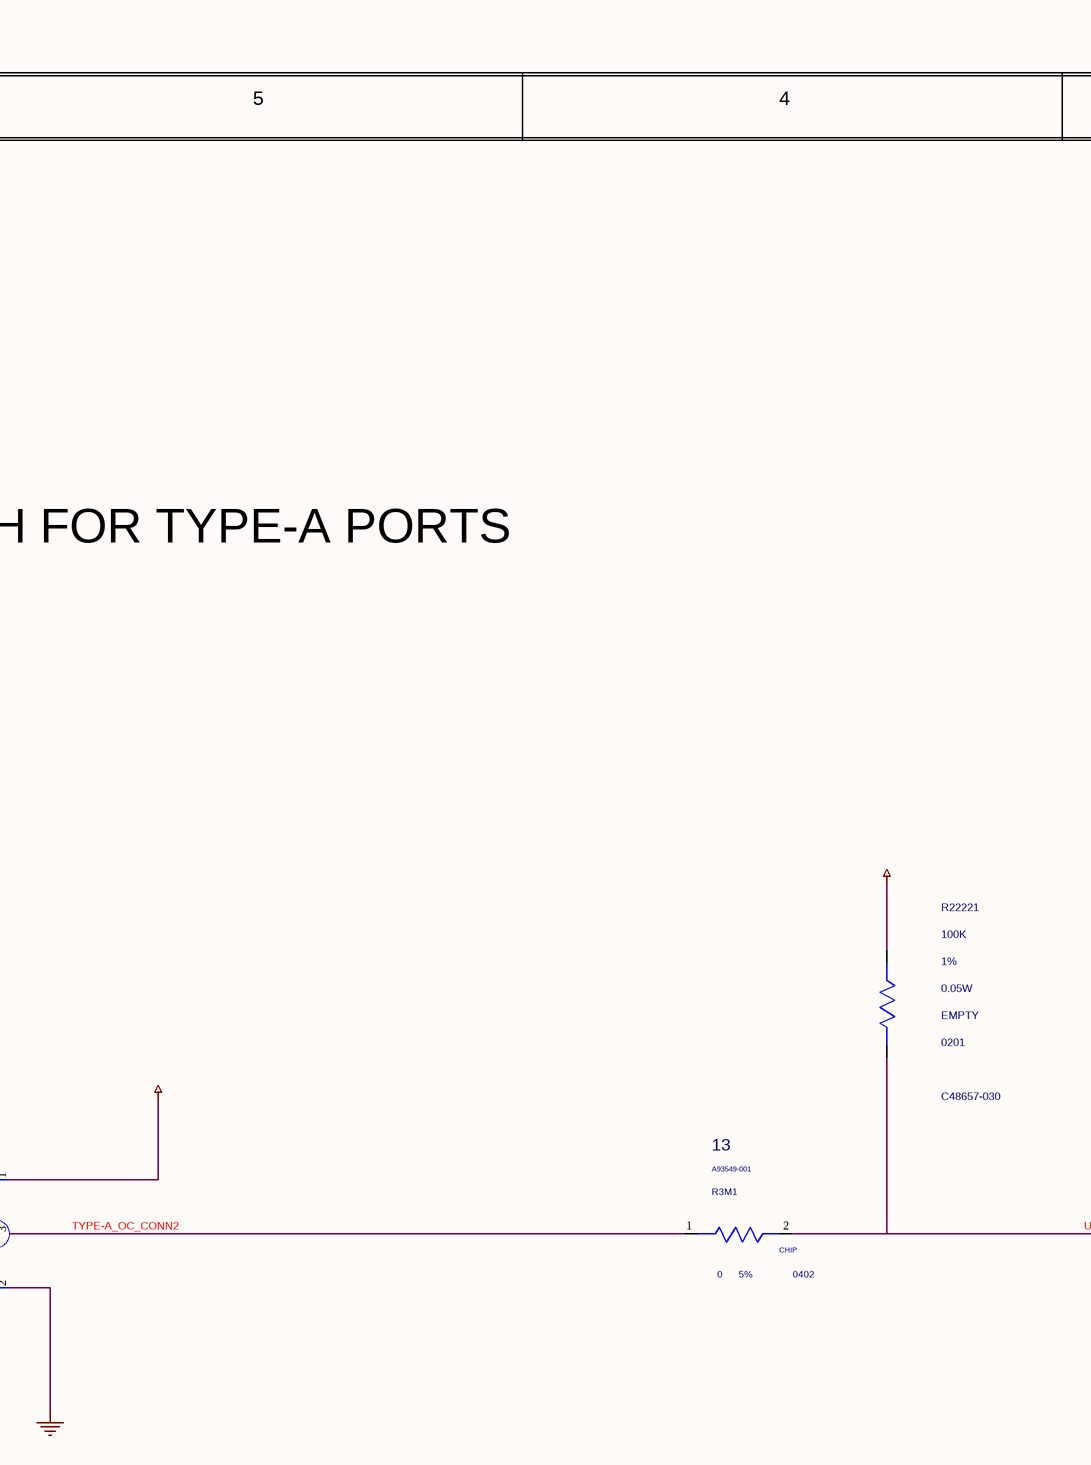
[diagram p143: 0084_USB3.SchDoc, top middle]
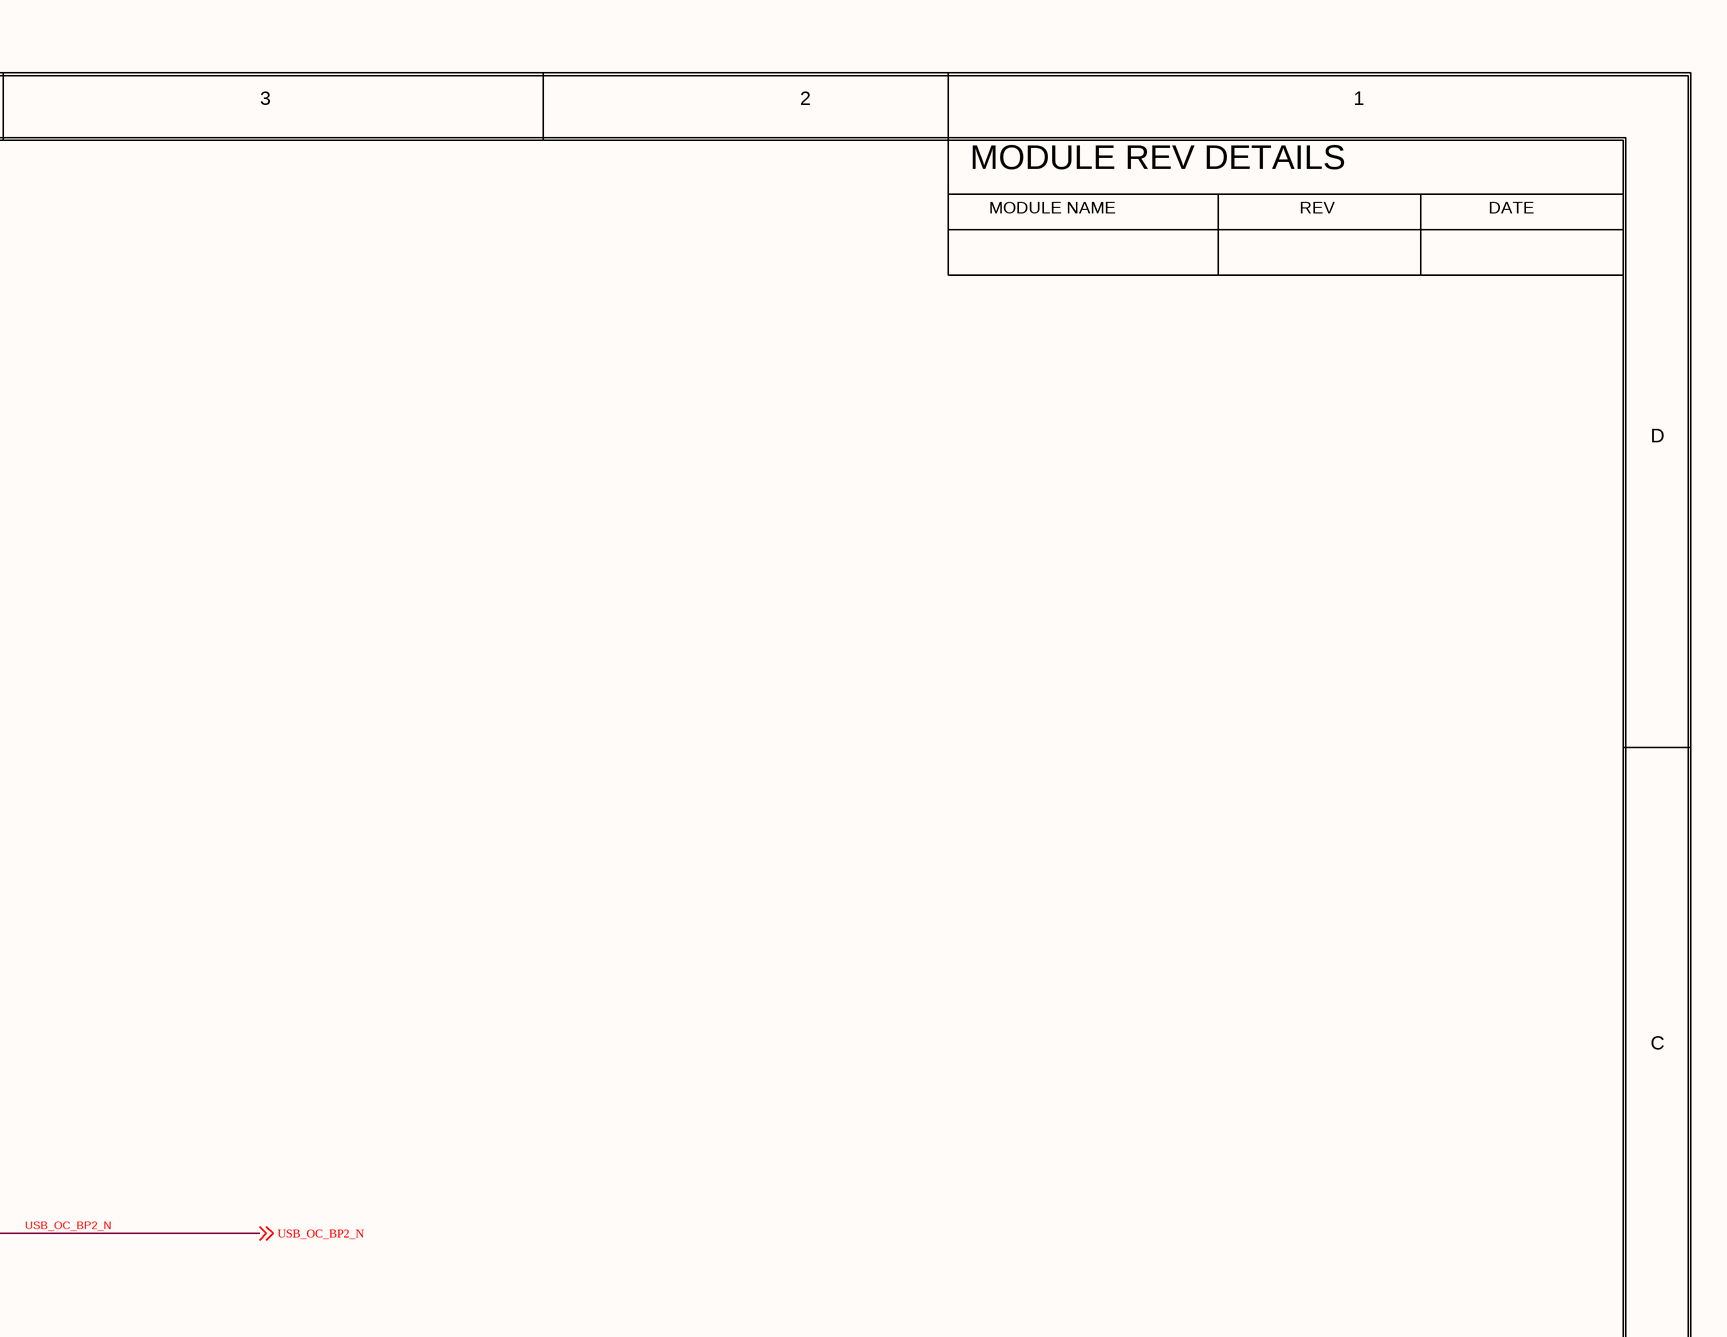
[diagram p144: 0084_USB3.SchDoc, top right]
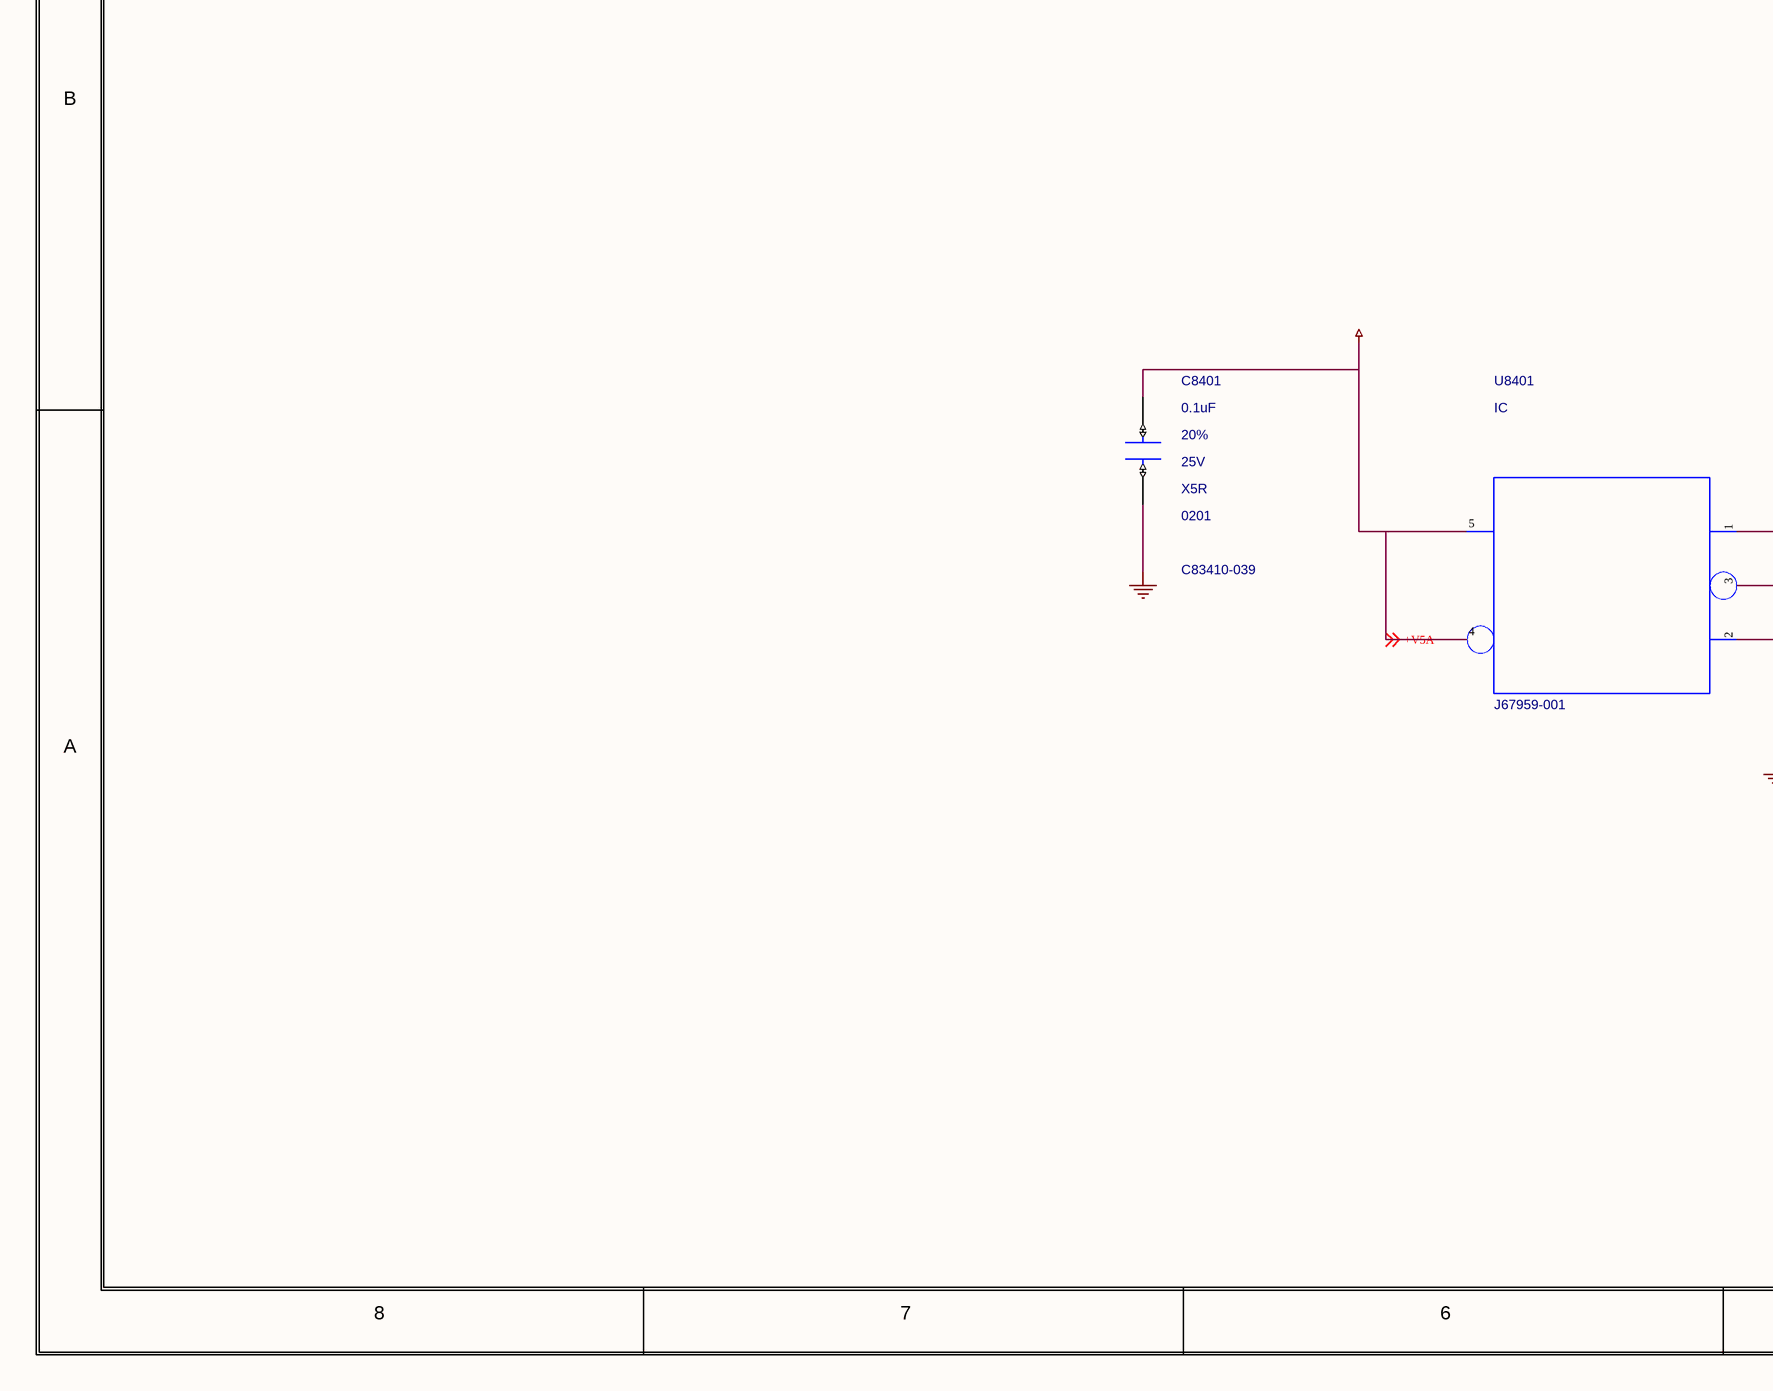
[diagram p145: 0084_USB3.SchDoc, bottom left]
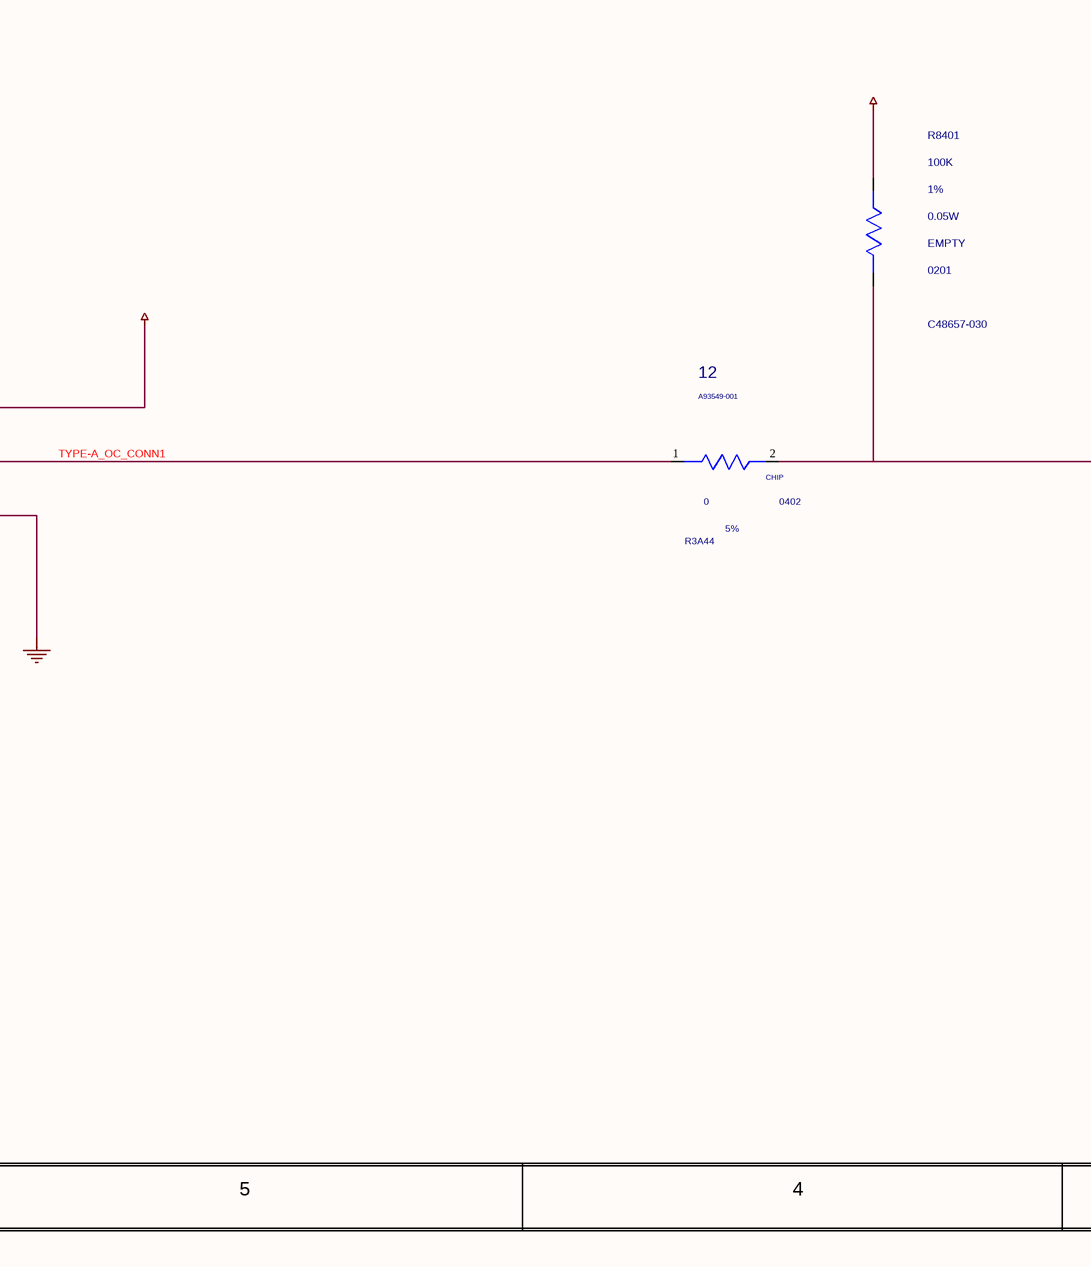
[diagram p146: 0084_USB3.SchDoc, bottom middle]
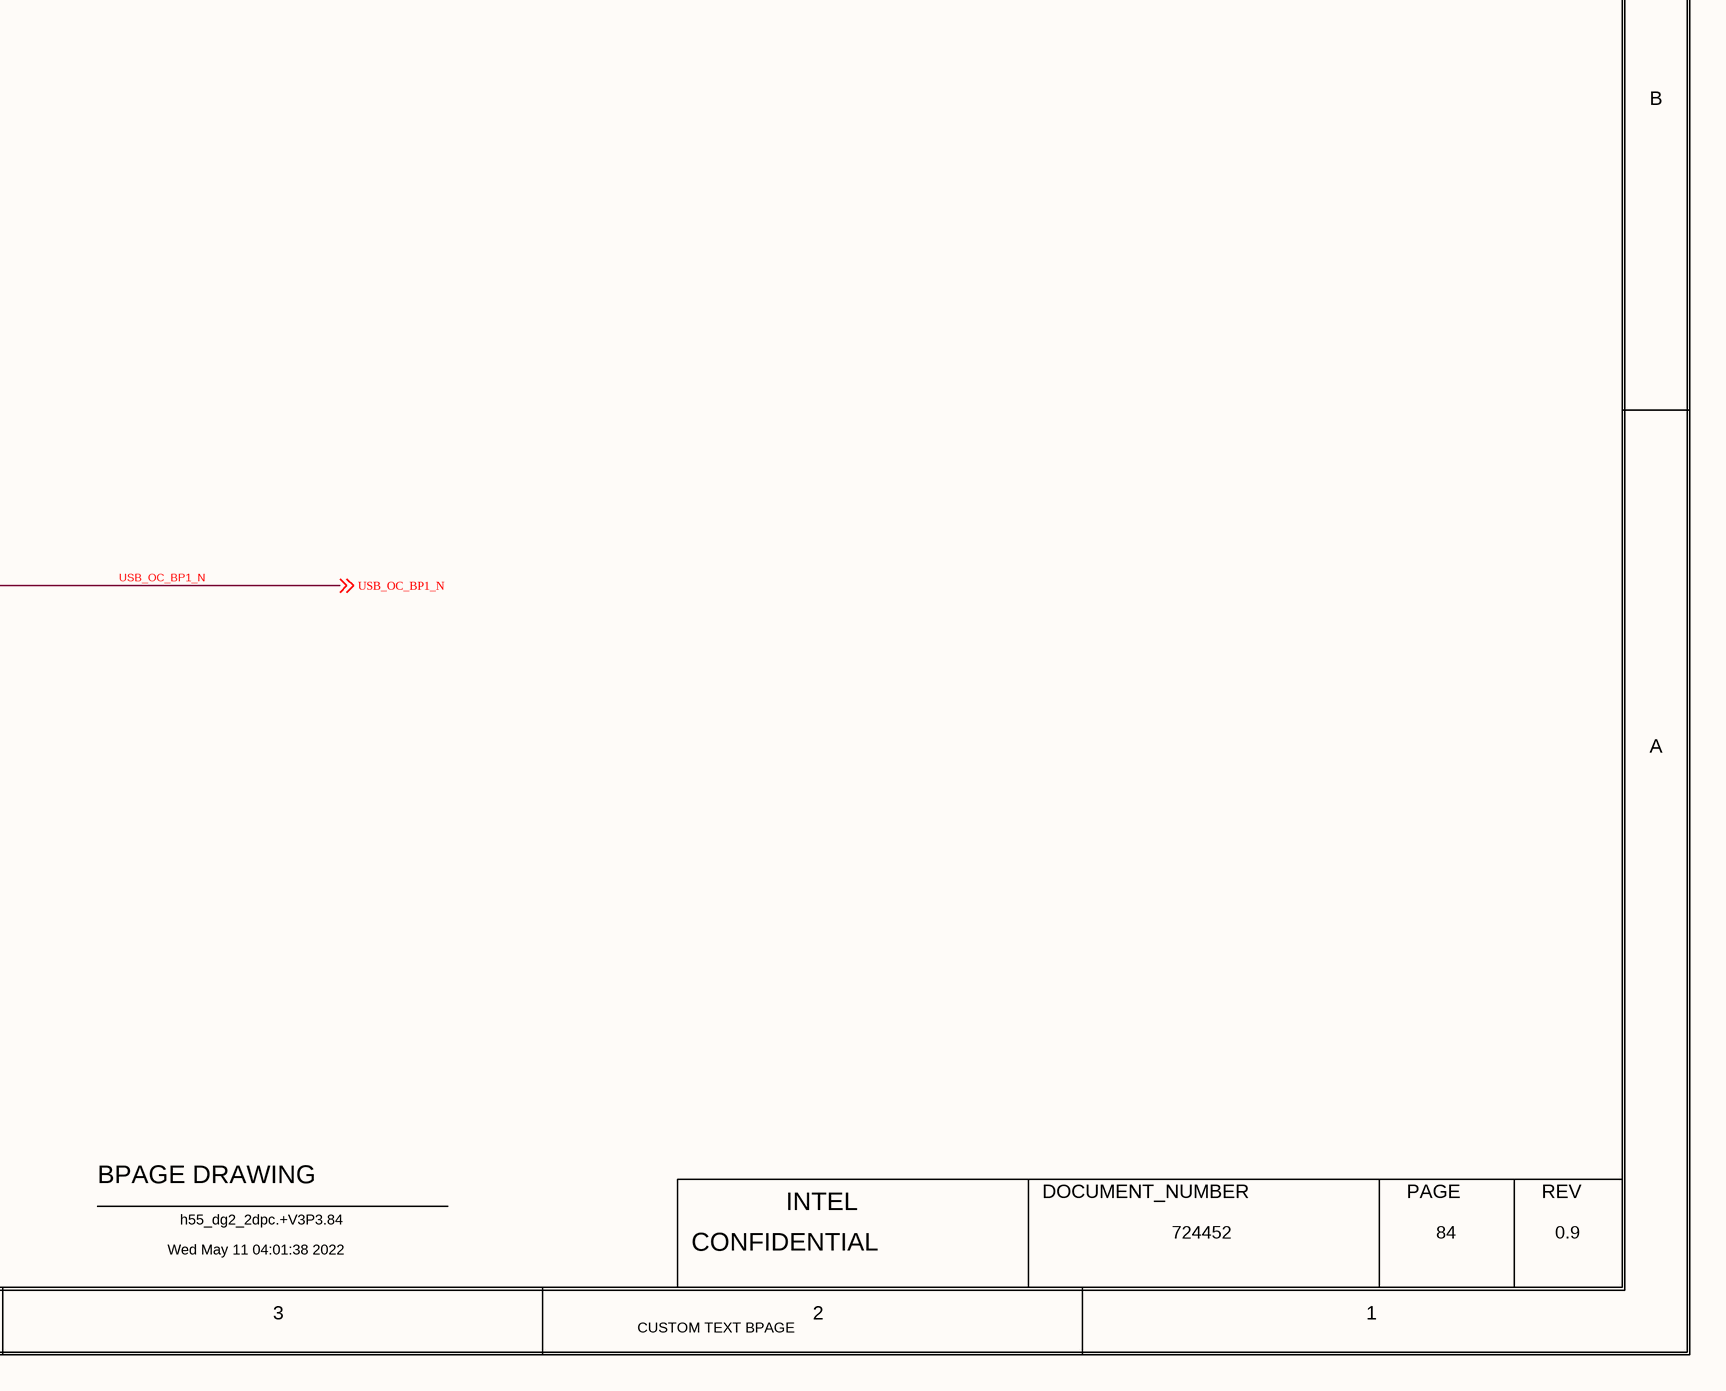
[diagram p147: 0084_USB3.SchDoc, bottom right]

### Parts
C8401  0.1uF  MATERIAL: X5R  PACK_TYPE: 0201  PART_NUMBER: C83410-039  TOLERANCE: 20%  VOLTAGE: 25V  [CTK0_SM0201_630X330_MA]
C22113  0.1uF  MATERIAL: X5R  PACK_TYPE: 0201  PART_NUMBER: C83410-039  TOLERANCE: 20%  VOLTAGE: 25V  [CTK0_SM0201_630X330_MA]
R3A44  0  MATERIAL: CHIP  PACK_TYPE: 0402  PART_NUMBER: A93549-001  TOLERANCE: 5%  REUSE_ID: 12  [SMR0402IA]
R3M1  0  MATERIAL: CHIP  PACK_TYPE: 0402  PART_NUMBER: A93549-001  TOLERANCE: 5%  REUSE_ID: 13  [SMR0402IA]
R8401  100K  MATERIAL: EMPTY  PACK_TYPE: 0201  PART_NUMBER: C48657-030  TOLERANCE: 1%  WATTAGE: 0.05W  [CTK0_SM0201_630X330_MA]
R22221  100K  MATERIAL: EMPTY  PACK_TYPE: 0201  PART_NUMBER: C48657-030  TOLERANCE: 1%  WATTAGE: 0.05W  [CTK0_SM0201_630X330_MA]
U8401  MATERIAL: IC  PART_NUMBER: J67959-001  [CTK2_TSOT23_5_1803X3099_939_MA]  (hidden comment: C_RT9742)
U8402  MATERIAL: IC  PART_NUMBER: J67959-001  [CTK2_TSOT23_5_1803X3099_939_MA]  (hidden comment: C_RT9742)

### Nets
+V3P3A: R8401.1(A) R22221.1(A)
+V5A: C8401.1(A) U8401.4(EN_EN_N) U8401.5(VIN) ; off-sheet +V5A
+V5A_L: C22113.1(A) U8402.4(EN_EN_N) U8402.5(VIN)
+V5A_USB_P1: U8402.1(VOUT)
+V5A_USB_P2: U8401.1(VOUT)
GND: C8401.2(B) C22113.2(B) U8401.2(GND) U8402.2(GND)  [project net EXP_A_RX_4_DP]
TYPE-A_OC_CONN1: R3A44.1(A) U8401.3(FLG_N)
TYPE-A_OC_CONN2: R3M1.1(A) U8402.3(FLG_N)
USB_OC_BP1_N: R3A44.2(B) R8401.2(B) ; off-sheet USB_OC_BP1_N
USB_OC_BP2_N: R3M1.2(B) R22221.2(B) ; off-sheet USB_OC_BP2_N

### Notes on the sheet
- <XR_PAGE_TITLE>
- 8
- 7
- 6
- 5
- 4
- 3
- 2
- 1
- MODULE REV DETAILS
- MODULE NAME
- REV
- DATE
- D
- USB3.1 POWER SWITCH FOR TYPE-A PORTS
- C
- B
- A
- BPAGE DRAWING
- INTEL
- DOCUMENT_NUMBER
- PAGE
- Wed May 11 04:01:38 2022
- h55_dg2_2dpc.+V3P3.84
- CONFIDENTIAL
- 724452
- 84
- 0.9
- CUSTOM TEXT BPAGE

### Library data of the parts
C8401 = C_CAP: CDS_PHYS_PART_NAME: C_CAP_0201-C83410-039,X5R,0.1UF,25V,20%,TK0,GENERIC; CDS_LMAN_SYM_OUTLINE: -50,50,50,-50; FP_TECH: TK0; IP: GENERIC; ROOM: NONE; OriginalSymbolOrigin: (-50,25); XY: (-6075,1550); VER: 1; ROT: 0; PHYS_PAGE: 84; LOCATION: C8401; FIN: EDP; DRAWING: @RVP1_ADL_SB_ADP_S_DDR5_SODIMM_2DPC_LIB.H55_DG2_2DPC(SCH_1):PAGE450; CDS_LIB: c_discrete; BOM: HDMI; VARIANT: ?; PCB Footprint: CTK0_SM0201_630X330_MA; CHIPS_PART_NAME: C_CAP; CDS_PART_NAME: C_CAP_0201-C83410-039,X5R,0.1UF,25V,20%,TK0,GENERIC; CDS_LOCATION: C8401; ASI_MODEL: C83410-039
C22113 = C_CAP: CDS_PHYS_PART_NAME: C_CAP_0201-C83410-039,X5R,0.1UF,25V,20%,TK0,GENERIC; CDS_LMAN_SYM_OUTLINE: -50,50,50,-50; FP_TECH: TK0; IP: GENERIC; ROOM: NONE; OriginalSymbolOrigin: (-50,25); XY: (-6050,3225); VER: 1; ROT: 0; PHYS_PAGE: 84; LOCATION: C22113; FIN: EDP; DRAWING: @RVP1_ADL_SB_ADP_S_DDR5_SODIMM_2DPC_LIB.H55_DG2_2DPC(SCH_1):PAGE450; CDS_LIB: c_discrete; BOM: HDMI; VARIANT: ?; PCB Footprint: CTK0_SM0201_630X330_MA; CHIPS_PART_NAME: C_CAP; CDS_PART_NAME: C_CAP_0201-C83410-039,X5R,0.1UF,25V,20%,TK0,GENERIC; CDS_LOCATION: C22113; ASI_MODEL: C83410-039
R3A44 = RES#1: CHIPS_PART_NAME: RES; CDS_PHYS_PART_NAME: RES_0402-A93549-001,CHIP,0,5%,1/16W,LPDB,GENERIC; WATTAGE: 1/16W; OriginalSymbolOrigin: (-75,25); XY: (-3625,1300); VER: 1; ROOM: ROOM_PROP_TEST_106; PHYS_PAGE: 84; LOCATION: R3A44; DRAWING: @RVP1_ADL_SB_ADP_S_DDR5_SODIMM_2DPC_LIB.H55_DG2_2DPC(SCH_1):PAGE450; CDS_LIB: discrete; PCB Footprint: SMR0402IA; ROT: 0; CDS_PART_NAME: RES_0402-A93549-001,CHIP,0,5%,1/16W,LPDB,GENERIC; CDS_LOCATION: R3A44
R3M1 = RES#1: CHIPS_PART_NAME: RES; CDS_PHYS_PART_NAME: RES_0402-A93549-001,CHIP,0,5%,1/16W,LPDB,GENERIC; WATTAGE: 1/16W; OriginalSymbolOrigin: (-75,25); XY: (-3600,2975); VER: 1; ROOM: ROOM_PROP_TEST_106; PHYS_PAGE: 84; LOCATION: R3M1; DRAWING: @RVP1_ADL_SB_ADP_S_DDR5_SODIMM_2DPC_LIB.H55_DG2_2DPC(SCH_1):PAGE450; CDS_LIB: discrete; PCB Footprint: SMR0402IA; ROT: 0; CDS_PART_NAME: RES_0402-A93549-001,CHIP,0,5%,1/16W,LPDB,GENERIC; CDS_LOCATION: R3M1
R8401 = C_RES: CDS_PHYS_PART_NAME: C_RES_0201-C48657-030,EMPTY,100K,1%,0.05W,TK0,GENERIC; CDS_LMAN_SYM_OUTLINE: -50,50,50,-50; FP_TECH: TK0; IP: GENERIC; ROOM: NONE; OriginalSymbolOrigin: (-25,75); XY: (-3350,1725); VER: 2; ROT: 0; PHYS_PAGE: 84; LOCATION: R8401; DRAWING: @RVP1_ADL_SB_ADP_S_DDR5_SODIMM_2DPC_LIB.H55_DG2_2DPC(SCH_1):PAGE450; CDS_LIB: c_discrete; VARIANT: ?; PCB Footprint: CTK0_SM0201_630X330_MA; SEC_TYPE: 0201; CHIPS_PART_NAME: C_RES; CDS_PART_NAME: C_RES_0201-C48657-030,EMPTY,100K,1%,0.05W,TK0,GENERIC; CDS_LOCATION: R8401
R22221 = C_RES: CDS_PHYS_PART_NAME: C_RES_0201-C48657-030,EMPTY,100K,1%,0.05W,TK0,GENERIC; CDS_LMAN_SYM_OUTLINE: -50,50,50,-50; FP_TECH: TK0; IP: GENERIC; ROOM: NONE; OriginalSymbolOrigin: (-25,75); XY: (-3325,3400); VER: 2; ROT: 0; PHYS_PAGE: 84; LOCATION: R22221; DRAWING: @RVP1_ADL_SB_ADP_S_DDR5_SODIMM_2DPC_LIB.H55_DG2_2DPC(SCH_1):PAGE450; CDS_LIB: c_discrete; VARIANT: ?; PCB Footprint: CTK0_SM0201_630X330_MA; SEC_TYPE: 0201; CHIPS_PART_NAME: C_RES; CDS_PART_NAME: C_RES_0201-C48657-030,EMPTY,100K,1%,0.05W,TK0,GENERIC; CDS_LOCATION: R22221
U8401 = C_RT9742: CDS_PHYS_PART_NAME: C_RT9742_SM-J67959-001,IC,RT9742GGJ5,TK2,GENERIC; CDS_LMAN_SYM_OUTLINE: -200,200,200,-200; FP_TECH: TK2; IP: GENERIC; PACK_TYPE: SM; ROOM: NONE; OriginalSymbolOrigin: (-250,200); XY: (-5225,1300); VER: 1; ROT: 0; PHYS_PAGE: 84; LOCATION: U8401; DRAWING: @RVP1_ADL_SB_ADP_S_DDR5_SODIMM_2DPC_LIB.H55_DG2_2DPC(SCH_1):PAGE450; CDS_LIB: local; VARIANT: ?; PCB Footprint: CTK2_TSOT23_5_1803X3099_939_MA; SEC_TYPE: SM; CHIPS_PART_NAME: C_RT9742; CDS_PART_NAME: C_RT9742_SM-J67959-001,IC,RT9742GGJ5,TK2,GENERIC; CDS_LOCATION: U8401
U8402 = C_RT9742: CDS_PHYS_PART_NAME: C_RT9742_SM-J67959-001,IC,RT9742GGJ5,TK2,GENERIC; CDS_LMAN_SYM_OUTLINE: -200,200,200,-200; FP_TECH: TK2; IP: GENERIC; PACK_TYPE: SM; ROOM: NONE; OriginalSymbolOrigin: (-250,200); XY: (-5200,2975); VER: 1; ROT: 0; PHYS_PAGE: 84; LOCATION: U8402; DRAWING: @RVP1_ADL_SB_ADP_S_DDR5_SODIMM_2DPC_LIB.H55_DG2_2DPC(SCH_1):PAGE450; CDS_LIB: local; VARIANT: ?; PCB Footprint: CTK2_TSOT23_5_1803X3099_939_MA; SEC_TYPE: SM; CHIPS_PART_NAME: C_RT9742; CDS_PART_NAME: C_RT9742_SM-J67959-001,IC,RT9742GGJ5,TK2,GENERIC; CDS_LOCATION: U8402

## Sheet 0090_USB3.SchDoc
size 848 x 558 mm
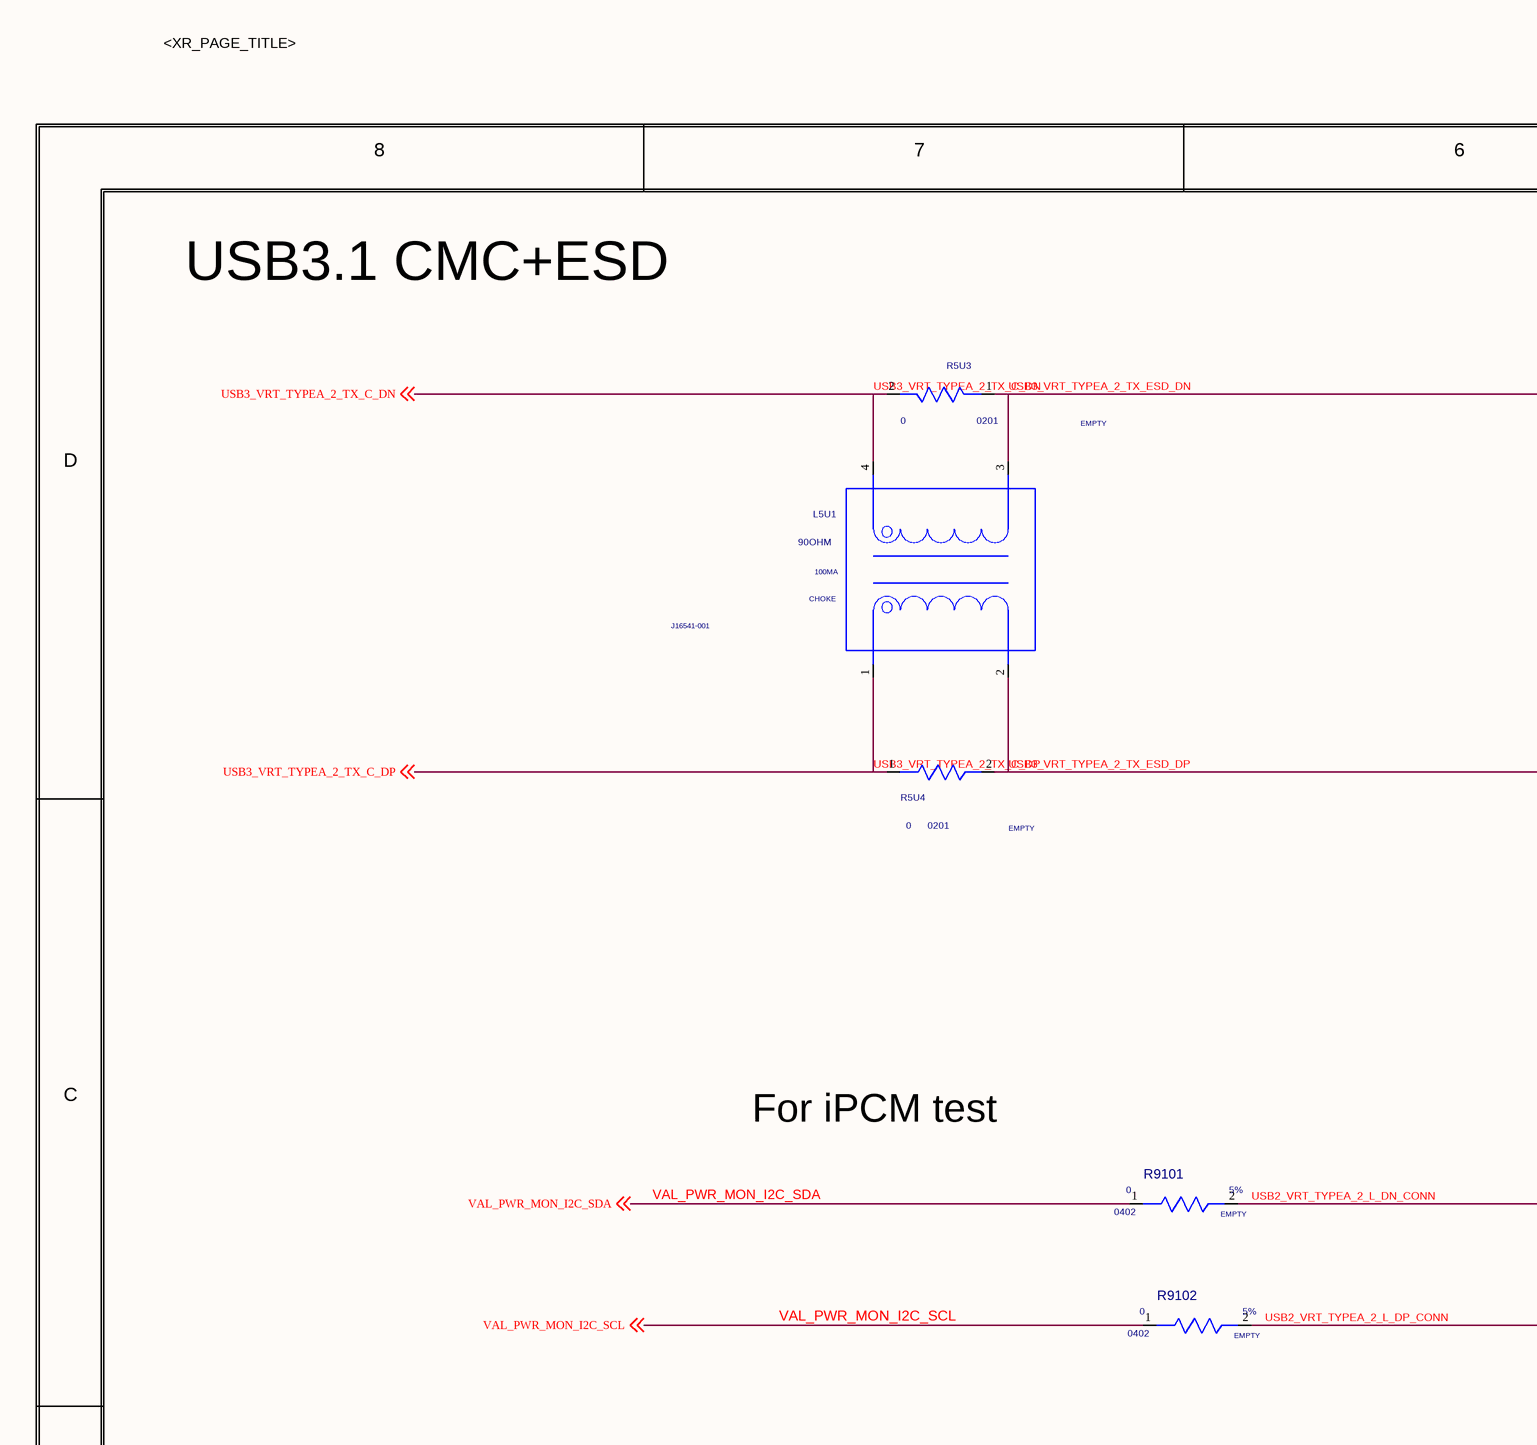
[diagram p148: 0090_USB3.SchDoc, top left]
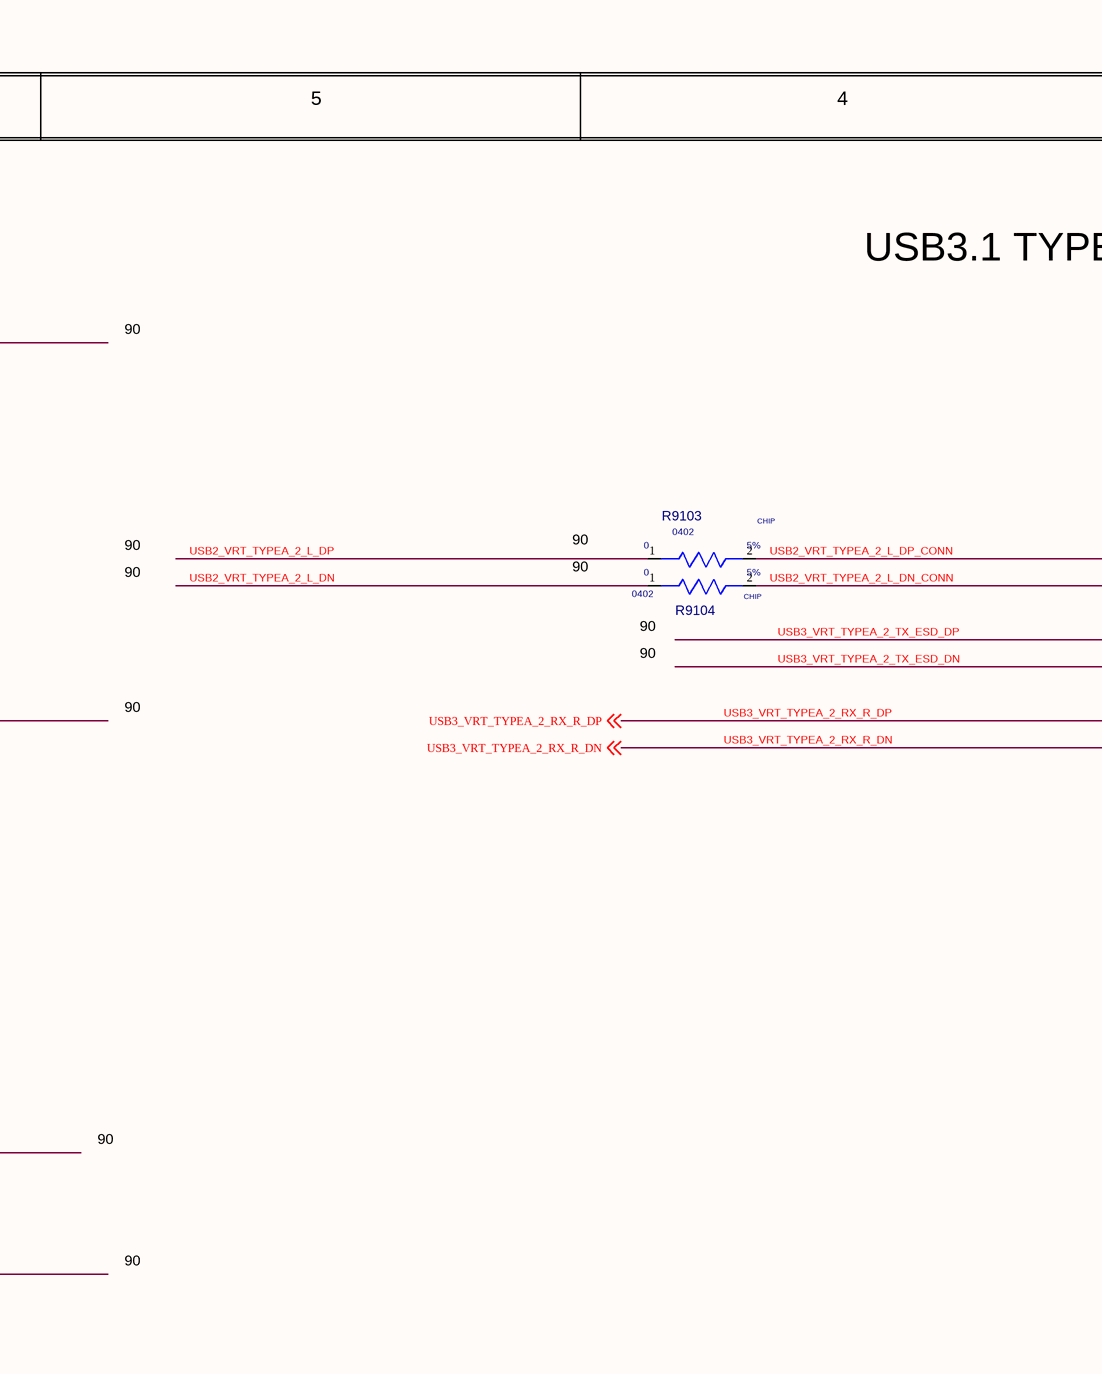
[diagram p149: 0090_USB3.SchDoc, top middle]
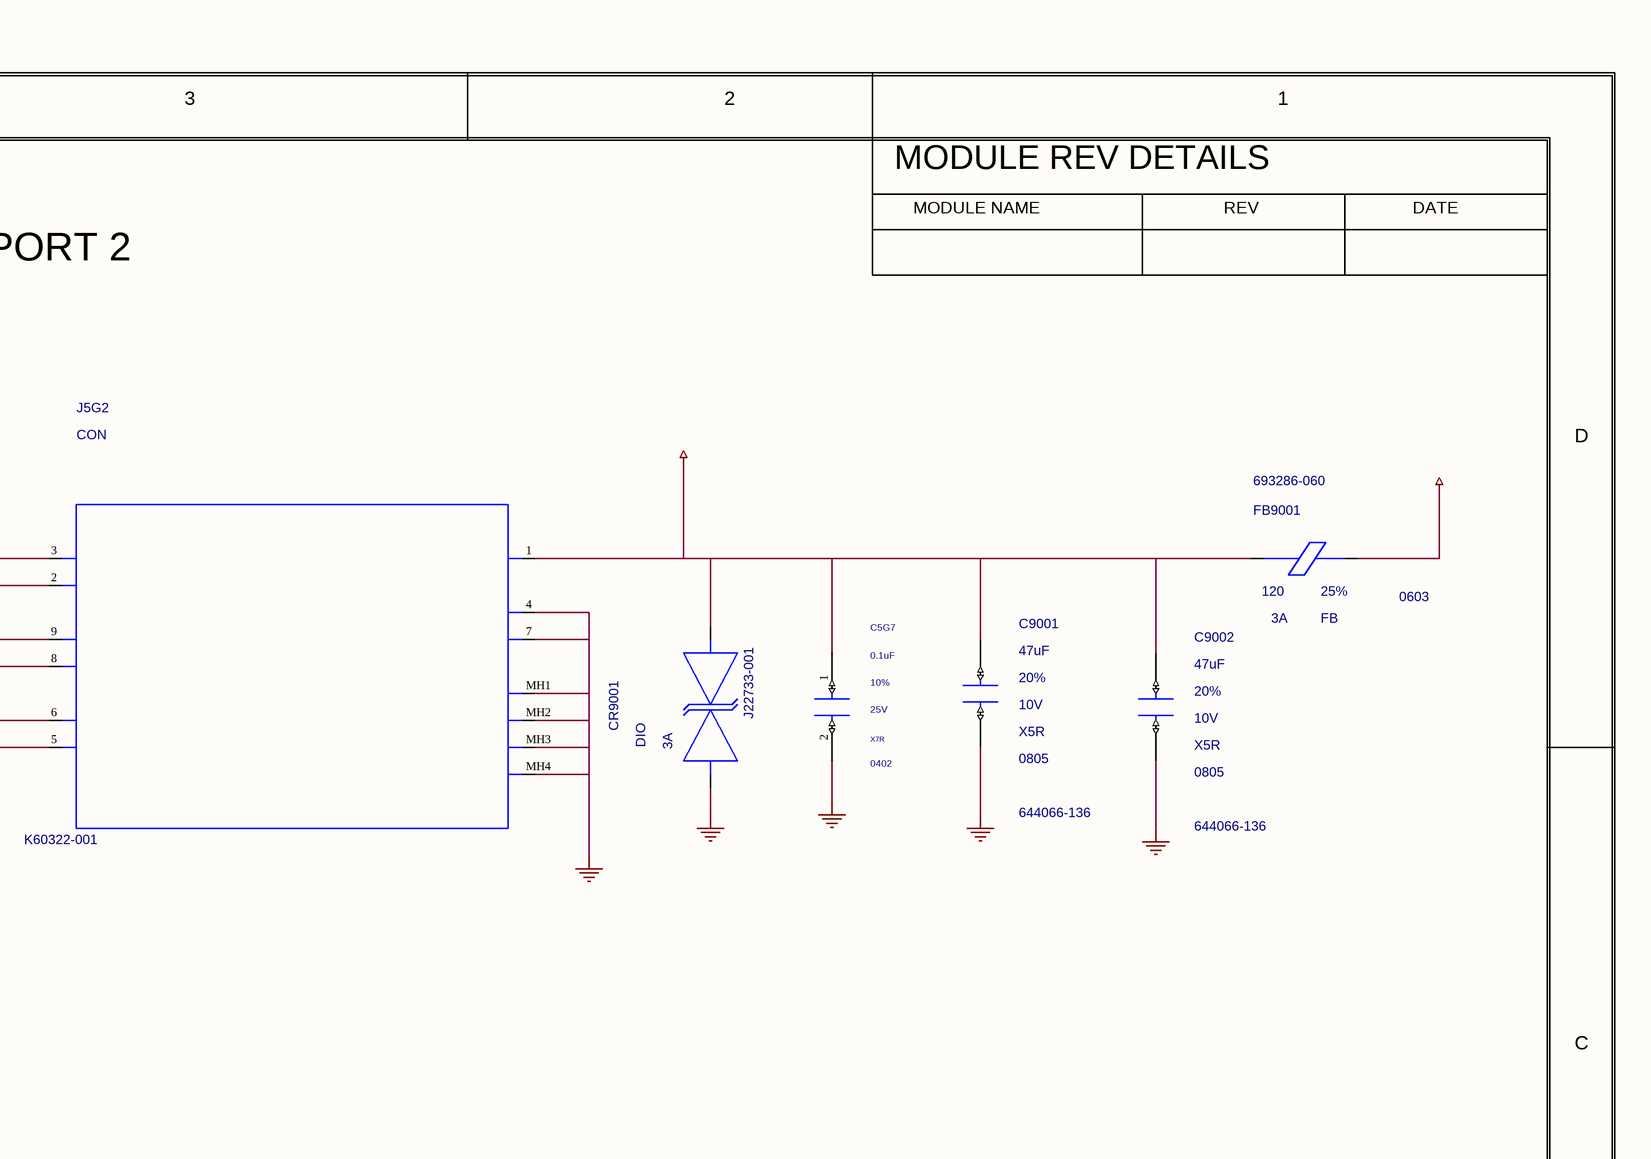
[diagram p150: 0090_USB3.SchDoc, top right]
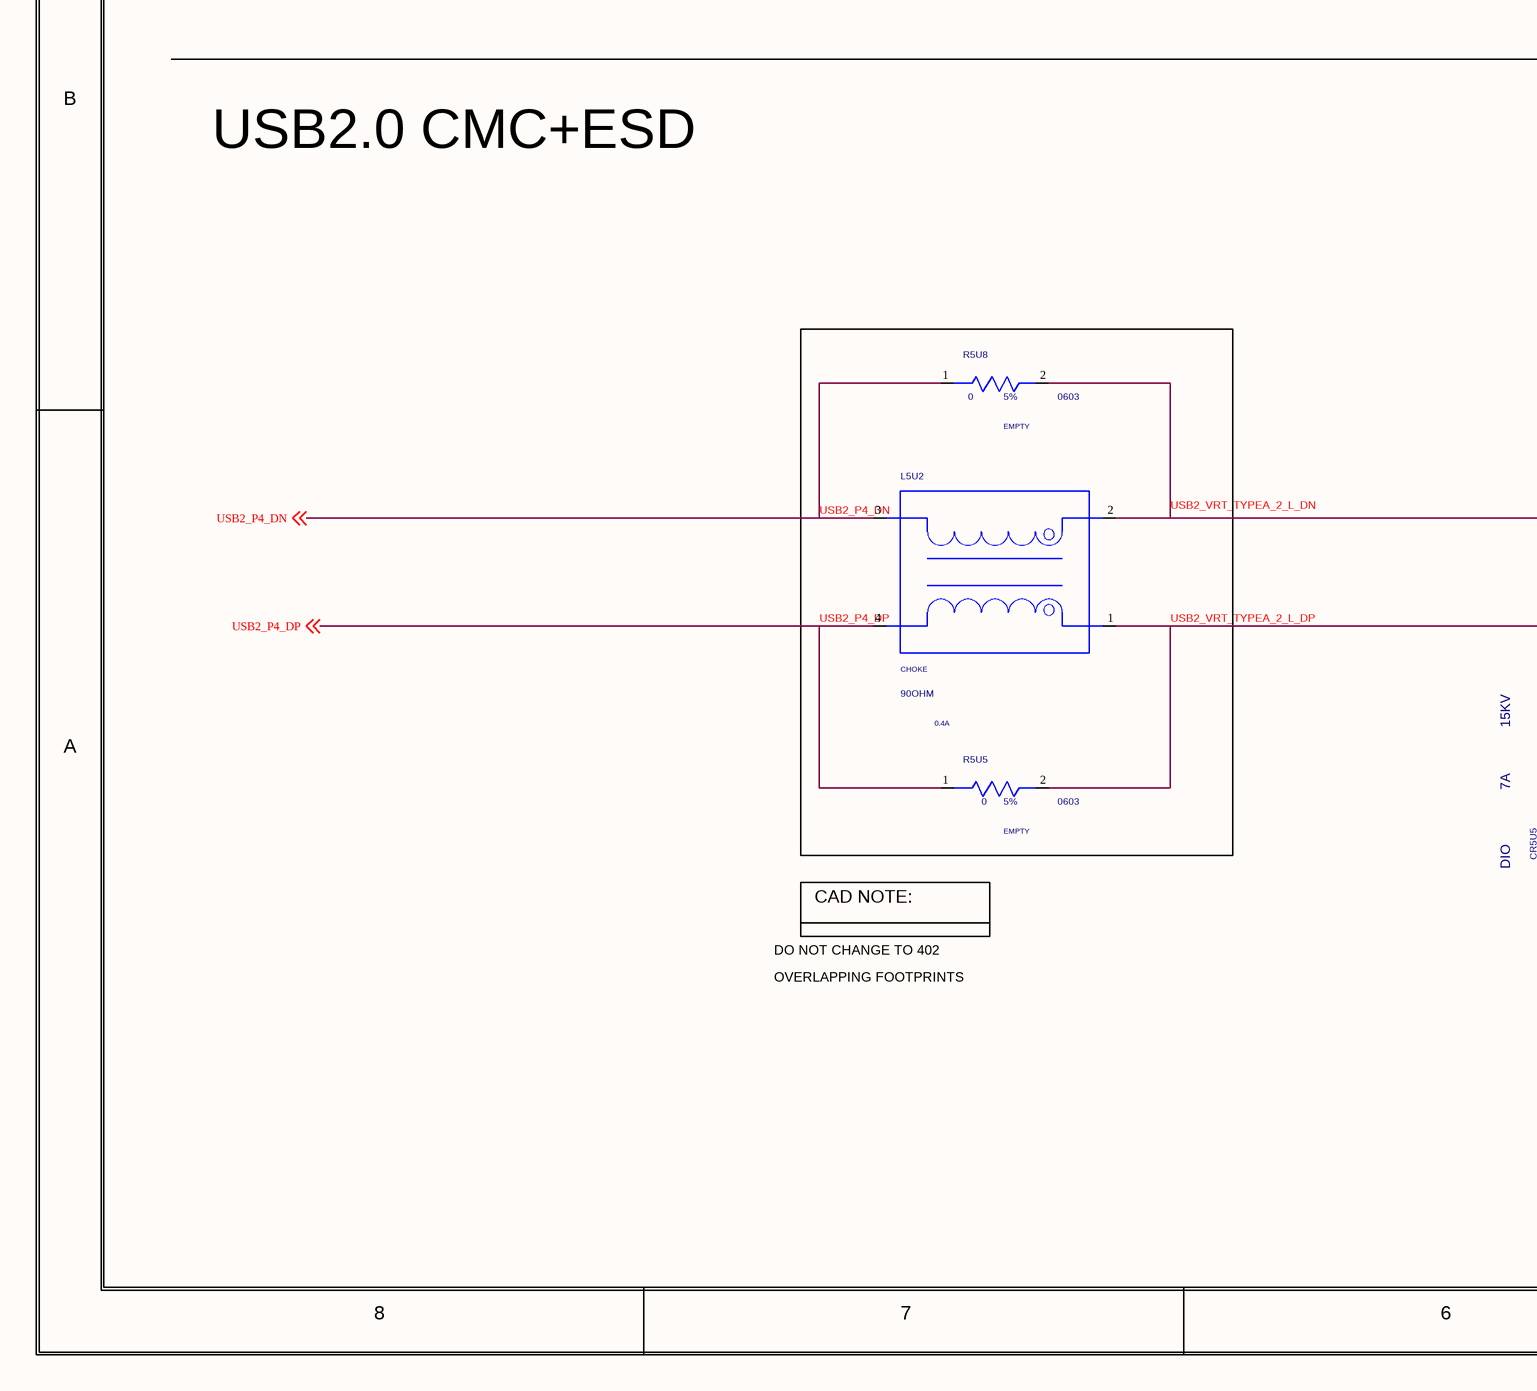
[diagram p151: 0090_USB3.SchDoc, bottom left]
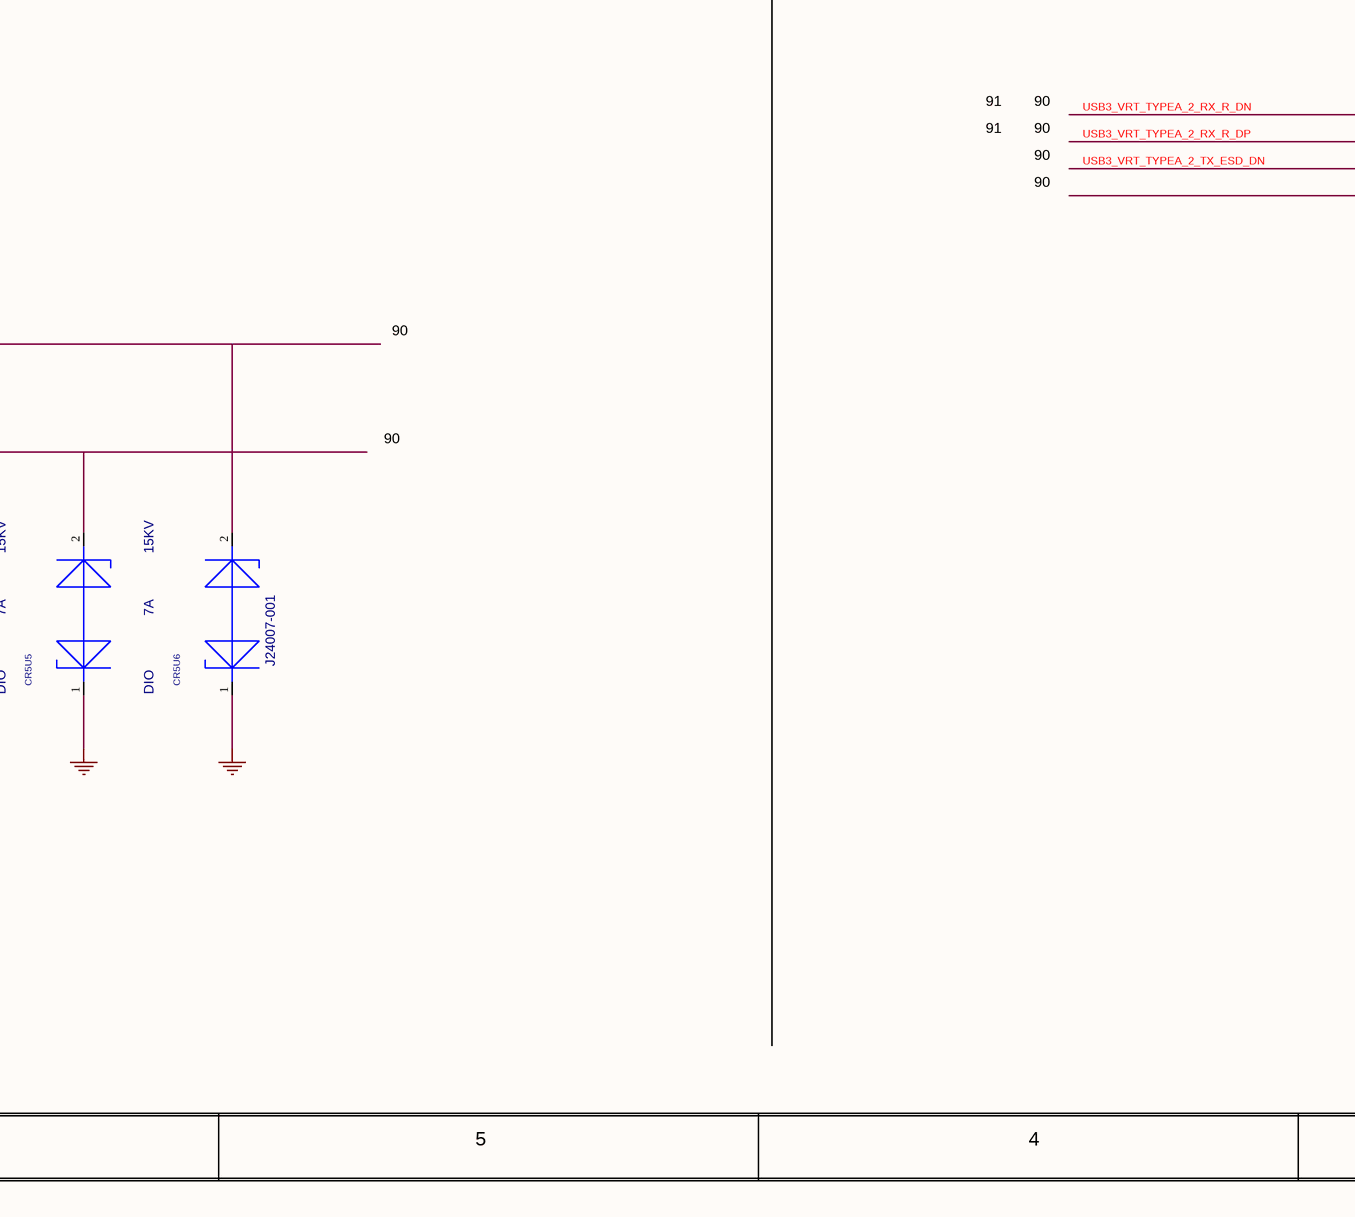
[diagram p152: 0090_USB3.SchDoc, bottom middle]
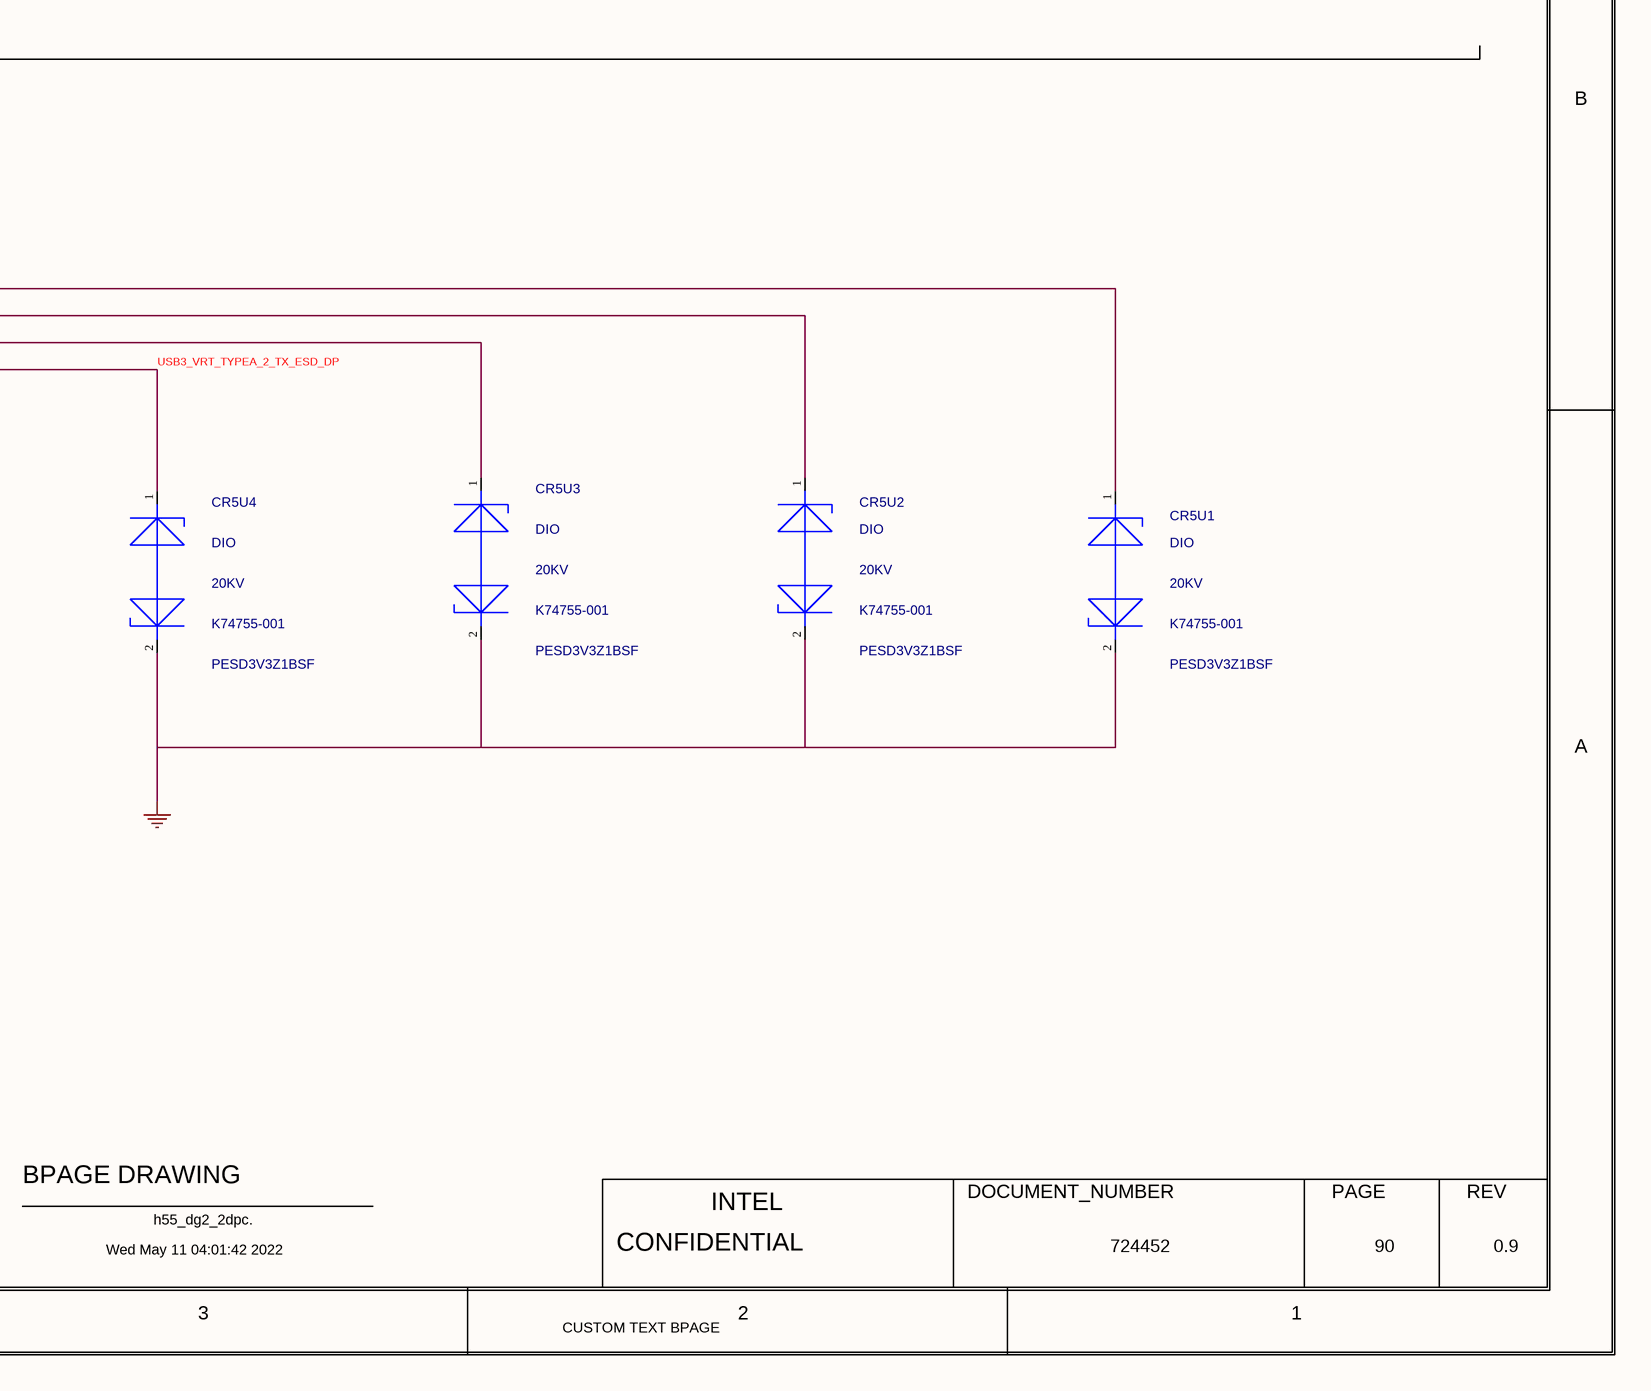
[diagram p153: 0090_USB3.SchDoc, bottom right]

### Parts
C5G7  0.1uF  MATERIAL: X7R  PACK_TYPE: 0402  TOLERANCE: 10%  VOLTAGE: 25V  [SMC0402IA]
C9001  47uF  MATERIAL: X5R  PACK_TYPE: 0805  PART_NUMBER: 644066-136  TOLERANCE: 20%  VOLTAGE: 10V  [CTK2_SM0805_2200X1450_MA]
C9002  47uF  MATERIAL: X5R  PACK_TYPE: 0805  PART_NUMBER: 644066-136  TOLERANCE: 20%  VOLTAGE: 10V  [CTK2_SM0805_2200X1450_MA]
CR5U1  PESD3V3Z1BSF  CURRENT: 20KV  MATERIAL: DIO  PART_NUMBER: K74755-001  [TK0_SCR_625X325_MB]
CR5U2  PESD3V3Z1BSF  CURRENT: 20KV  MATERIAL: DIO  PART_NUMBER: K74755-001  [TK0_SCR_625X325_MB]
CR5U3  PESD3V3Z1BSF  CURRENT: 20KV  MATERIAL: DIO  PART_NUMBER: K74755-001  [TK0_SCR_625X325_MB]
CR5U4  PESD3V3Z1BSF  CURRENT: 20KV  MATERIAL: DIO  PART_NUMBER: K74755-001  [TK0_SCR_625X325_MB]
CR5U5  15KV  CURRENT: 7A  MATERIAL: DIO  [TK0_SOD962_600X300_MA]
CR5U6  15KV  CURRENT: 7A  MATERIAL: DIO  PART_NUMBER: J24007-001  [TK0_SOD962_600X300_MA]
CR9001  CURRENT: 3A  MATERIAL: DIO  PART_NUMBER: J22733-001  [CTK2_SCR0201_610X310_MA]  (hidden comment: ESD200-B1-CSP0201)
FB9001  120  CURRENT: 3A  MATERIAL: FB  PACK_TYPE: 0603  PART_NUMBER: 693286-060  TOLERANCE: 25%  [CTK2_SM0603_1750X950_MA]
J5G2  MATERIAL: CON  PART_NUMBER: K60322-001  [CUSB3_MIDJR_9P_4EM_2000_MA_PIP_MR]  (hidden comment: C_USB3_TYPE_A_9P_4EM)
L5U1  90OHM  CURRENT: 100MA  MATERIAL: CHOKE  PART_NUMBER: J16541-001  [SMI4_50X65MA]
L5U2  90OHM  CURRENT: 0.4A  MATERIAL: CHOKE  [SMI4_79X47IA]
R5U3  0  MATERIAL: EMPTY  PACK_TYPE: 0201  [SMR0201IA]
R5U4  0  MATERIAL: EMPTY  PACK_TYPE: 0201  [SMR0201IA]
R5U5  0  MATERIAL: EMPTY  PACK_TYPE: 0603  TOLERANCE: 5%  [SMR0603IA]
R5U8  0  MATERIAL: EMPTY  PACK_TYPE: 0603  TOLERANCE: 5%  [SMR0603IA]
R9101  0  MATERIAL: EMPTY  PACK_TYPE: 0402  TOLERANCE: 5%  [SMR0402IA]
R9102  0  MATERIAL: EMPTY  PACK_TYPE: 0402  TOLERANCE: 5%  [SMR0402IA]
R9103  0  MATERIAL: CHIP  PACK_TYPE: 0402  TOLERANCE: 5%  [SMR0402IA]
R9104  0  MATERIAL: CHIP  PACK_TYPE: 0402  TOLERANCE: 5%  [SMR0402IA]

### Nets
+V5A_USB_P2: FB9001.2(B)
+V5A_USB_P2_FB: C5G7.1(A) C9001.1(A) C9002.1(A) CR9001.2(A2) FB9001.1(A) J5G2.1(VBUS_POWER)
GND: C5G7.2(B) C9001.2(B) C9002.2(B) CR5U1.2(K2) CR5U2.2(K2) CR5U3.2(K2) CR5U4.2(K2) CR5U5.1(K1) CR5U6.1(K1) CR9001.1(A1) J5G2.4(GND_POWER_RETURN) J5G2.7(GND) J5G2.MH1 J5G2.MH2 J5G2.MH3 J5G2.MH4  [project net EXP_A_RX_4_DP]
USB2_P4_DN: L5U2.3(IN_2) R5U8.1(A) ; off-sheet USB2_P4_DN
USB2_P4_DP: L5U2.4(OUT_1) R5U5.1(A) ; off-sheet USB2_P4_DP
USB2_VRT_TYPEA_2_L_DN: CR5U6.2(K2) L5U2.2(OUT_2) R5U8.2(B) R9104.1(A)
USB2_VRT_TYPEA_2_L_DN_CONN: J5G2.2(D_DN) R9101.2(B) R9104.2(B)
USB2_VRT_TYPEA_2_L_DP: CR5U5.2(K2) L5U2.1(IN_1) R5U5.2(B) R9103.1(A)
USB2_VRT_TYPEA_2_L_DP_CONN: J5G2.3(D_DP) R9102.2(B) R9103.2(B)
USB3_VRT_TYPEA_2_RX_R_DN: CR5U1.1(K1) J5G2.5(SSRX_DN) ; off-sheet USB3_VRT_TYPEA_2_RX_R_DN
USB3_VRT_TYPEA_2_RX_R_DP: CR5U2.1(K1) J5G2.6(SSRX_DP) ; off-sheet USB3_VRT_TYPEA_2_RX_R_DP
USB3_VRT_TYPEA_2_TX_C_DN: L5U1.4(PIN4) R5U3.2(B) ; off-sheet USB3_VRT_TYPEA_2_TX_C_DN
USB3_VRT_TYPEA_2_TX_C_DP: L5U1.1(PIN1) R5U4.1(A) ; off-sheet USB3_VRT_TYPEA_2_TX_C_DP
USB3_VRT_TYPEA_2_TX_ESD_DN: CR5U3.1(K1) J5G2.8(SSTX_DN) L5U1.3(PIN3) R5U3.1(A)
USB3_VRT_TYPEA_2_TX_ESD_DP: CR5U4.1(K1) J5G2.9(SSTX_DP) L5U1.2(PIN2) R5U4.2(B)
VAL_PWR_MON_I2C_SCL: R9102.1(A) ; off-sheet VAL_PWR_MON_I2C_SCL
VAL_PWR_MON_I2C_SDA: R9101.1(A) ; off-sheet VAL_PWR_MON_I2C_SDA

### Notes on the sheet
- <XR_PAGE_TITLE>
- 8
- 7
- 6
- 5
- 4
- 3
- 2
- 1
- MODULE REV DETAILS
- USB3.1 CMC+ESD
- USB3.1 TYPE-A  PORT 2
- MODULE NAME
- REV
- DATE
- 90
- D
- (near R9104) 90
- C
- For iPCM test
- B
- USB2.0 CMC+ESD
- 91
- A
- CAD NOTE:
- OVERLAPPING FOOTPRINTS
- DO NOT CHANGE TO 402
- BPAGE DRAWING
- INTEL
- DOCUMENT_NUMBER
- PAGE
- Wed May 11 04:01:42 2022
- h55_dg2_2dpc.
- CONFIDENTIAL
- 724452
- 0.9
- CUSTOM TEXT BPAGE

### Library data of the parts
C5G7 = CAP: PART_NUMBER: A36096-112; CDS_PHYS_PART_NAME: CAP_0402-A36096-112,X7R,0.1UF,25V,10%,LPDB,GENERIC; OriginalSymbolOrigin: (-50,25); XY: (-3350,3750); VER: 1; ROT: 0; PHYS_PAGE: 90; LOCATION: C5G7; IP: GENERIC; FP_TECH: LPDB; DRAWING: @RVP1_ADL_SB_ADP_S_DDR5_SODIMM_2DPC_LIB.H55_DG2_2DPC(SCH_1):PAGE461; CDS_LIB: discrete; PCB Footprint: SMC0402IA; SEC_TYPE: 0402; CHIPS_PART_NAME: CAP; CDS_PART_NAME: CAP_0402-A36096-112,X7R,0.1UF,25V,10%,LPDB,GENERIC; CDS_LOCATION: C5G7; ASI_MODEL: A36096-112
C9001 = C_CAP: CDS_PHYS_PART_NAME: C_CAP_0805-644066-136,X5R,47UF,10V,20%,TK2,GENERIC; CDS_LMAN_SYM_OUTLINE: -50,50,50,-50; FP_TECH: TK2; IP: GENERIC; ROOM: NONE; OriginalSymbolOrigin: (-50,25); XY: (-3075,3775); VER: 1; ROT: 0; PHYS_PAGE: 90; LOCATION: C9001; DRAWING: @RVP1_ADL_SB_ADP_S_DDR5_SODIMM_2DPC_LIB.H55_DG2_2DPC(SCH_1):PAGE461; CDS_LIB: c_discrete; VARIANT: ?; PCB Footprint: CTK2_SM0805_2200X1450_MA; CHIPS_PART_NAME: C_CAP; CDS_PART_NAME: C_CAP_0805-644066-136,X5R,47UF,10V,20%,TK2,GENERIC; CDS_LOCATION: C9001
C9002 = C_CAP: CDS_PHYS_PART_NAME: C_CAP_0805-644066-136,X5R,47UF,10V,20%,TK2,GENERIC; CDS_LMAN_SYM_OUTLINE: -50,50,50,-50; FP_TECH: TK2; IP: GENERIC; ROOM: NONE; OriginalSymbolOrigin: (-50,25); XY: (-2750,3750); VER: 1; ROT: 0; PHYS_PAGE: 90; LOCATION: C9002; DRAWING: @RVP1_ADL_SB_ADP_S_DDR5_SODIMM_2DPC_LIB.H55_DG2_2DPC(SCH_1):PAGE461; CDS_LIB: c_discrete; VARIANT: ?; PCB Footprint: CTK2_SM0805_2200X1450_MA; CHIPS_PART_NAME: C_CAP; CDS_PART_NAME: C_CAP_0805-644066-136,X5R,47UF,10V,20%,TK2,GENERIC; CDS_LOCATION: C9002
CR5U1 = DIODE_ESD_BIDIR_2: CDS_PHYS_PART_NAME: DIODE_ESD_BIDIR_2_SOD962-K74755-001,DIO,PESD3V3Z1BSF,20KV,TK0,GA; BOM_USE: STUFF; CDS_LMAN_SYM_OUTLINE: -150,150,150,-150; FP_TECH: TK0; IP: GENERIC; PACK_TYPE: SOD962; ROOM: NONE; OriginalSymbolOrigin: (-125,50); XY: (-2825,1125); VER: 1; ROT: 5; PHYS_PAGE: 90; LOCATION: CR5U1; DRAWING: @RVP1_ADL_SB_ADP_S_DDR5_SODIMM_2DPC_LIB.H55_DG2_2DPC(SCH_1):PAGE461; CDS_LIB: discrete_2; VARIANT: ?; PCB Footprint: TK0_SCR_625X325_MB; CHIPS_PART_NAME: DIODE_ESD_BIDIR_2; CDS_PART_NAME: DIODE_ESD_BIDIR_2_SOD962-K74755-001,DIO,PESD3V3Z1BSF,20KV,TK0,GA; CDS_LOCATION: CR5U1
CR5U2 = DIODE_ESD_BIDIR_2: CDS_PHYS_PART_NAME: DIODE_ESD_BIDIR_2_SOD962-K74755-001,DIO,PESD3V3Z1BSF,20KV,TK0,GA; BOM_USE: STUFF; CDS_LMAN_SYM_OUTLINE: -150,150,150,-150; FP_TECH: TK0; IP: GENERIC; PACK_TYPE: SOD962; ROOM: NONE; OriginalSymbolOrigin: (-125,50); XY: (-3400,1150); VER: 1; ROT: 5; PHYS_PAGE: 90; LOCATION: CR5U2; DRAWING: @RVP1_ADL_SB_ADP_S_DDR5_SODIMM_2DPC_LIB.H55_DG2_2DPC(SCH_1):PAGE461; CDS_LIB: discrete_2; VARIANT: ?; PCB Footprint: TK0_SCR_625X325_MB; CHIPS_PART_NAME: DIODE_ESD_BIDIR_2; CDS_PART_NAME: DIODE_ESD_BIDIR_2_SOD962-K74755-001,DIO,PESD3V3Z1BSF,20KV,TK0,GA; CDS_LOCATION: CR5U2
CR5U3 = DIODE_ESD_BIDIR_2: CDS_PHYS_PART_NAME: DIODE_ESD_BIDIR_2_SOD962-K74755-001,DIO,PESD3V3Z1BSF,20KV,TK0,GA; BOM_USE: STUFF; CDS_LMAN_SYM_OUTLINE: -150,150,150,-150; FP_TECH: TK0; IP: GENERIC; PACK_TYPE: SOD962; ROOM: NONE; OriginalSymbolOrigin: (-125,50); XY: (-4000,1150); VER: 1; ROT: 5; PHYS_PAGE: 90; LOCATION: CR5U3; DRAWING: @RVP1_ADL_SB_ADP_S_DDR5_SODIMM_2DPC_LIB.H55_DG2_2DPC(SCH_1):PAGE461; CDS_LIB: discrete_2; VARIANT: ?; PCB Footprint: TK0_SCR_625X325_MB; CHIPS_PART_NAME: DIODE_ESD_BIDIR_2; CDS_PART_NAME: DIODE_ESD_BIDIR_2_SOD962-K74755-001,DIO,PESD3V3Z1BSF,20KV,TK0,GA; CDS_LOCATION: CR5U3
CR5U4 = DIODE_ESD_BIDIR_2: CDS_PHYS_PART_NAME: DIODE_ESD_BIDIR_2_SOD962-K74755-001,DIO,PESD3V3Z1BSF,20KV,TK0,GA; BOM_USE: STUFF; CDS_LMAN_SYM_OUTLINE: -150,150,150,-150; FP_TECH: TK0; IP: GENERIC; PACK_TYPE: SOD962; ROOM: NONE; OriginalSymbolOrigin: (-125,50); XY: (-4600,1125); VER: 1; ROT: 5; PHYS_PAGE: 90; LOCATION: CR5U4; DRAWING: @RVP1_ADL_SB_ADP_S_DDR5_SODIMM_2DPC_LIB.H55_DG2_2DPC(SCH_1):PAGE461; CDS_LIB: discrete_2; VARIANT: ?; PCB Footprint: TK0_SCR_625X325_MB; CHIPS_PART_NAME: DIODE_ESD_BIDIR_2; CDS_PART_NAME: DIODE_ESD_BIDIR_2_SOD962-K74755-001,DIO,PESD3V3Z1BSF,20KV,TK0,GA; CDS_LOCATION: CR5U4
CR5U5 = DIODE_ESD_BIDIR_2: PART_NUMBER: J24007-001; CDS_PHYS_PART_NAME: DIODE_ESD_BIDIR_2_SOD962-J24007-001,DIO,15KV,7A,TK0,GENERIC; BOM_USE: STUFF; CDS_LMAN_SYM_OUTLINE: -150,150,150,-150; FP_TECH: TK0; IP: GENERIC; PACK_TYPE: SOD962; ROOM: NONE; OriginalSymbolOrigin: (-125,50); XY: (-7275,725); VER: 1; PHYS_PAGE: 90; LOCATION: CR5U5; DRAWING: @RVP1_ADL_SB_ADP_S_DDR5_SODIMM_2DPC_LIB.H55_DG2_2DPC(SCH_1):PAGE461; CDS_LIB: discrete_2; VARIANT: ?; PCB Footprint: TK0_SOD962_600X300_MA; ROT: 1; CHIPS_PART_NAME: DIODE_ESD_BIDIR_2; CDS_PART_NAME: DIODE_ESD_BIDIR_2_SOD962-J24007-001,DIO,15KV,7A,TK0,GENERIC; CDS_LOCATION: CR5U5; ASI_MODEL: J24007-001
CR5U6 = DIODE_ESD_BIDIR_2: CDS_PHYS_PART_NAME: DIODE_ESD_BIDIR_2_SOD962-J24007-001,DIO,15KV,7A,TK0,GENERIC; BOM_USE: STUFF; CDS_LMAN_SYM_OUTLINE: -150,150,150,-150; FP_TECH: TK0; IP: GENERIC; PACK_TYPE: SOD962; ROOM: NONE; OriginalSymbolOrigin: (-125,50); XY: (-7000,725); VER: 1; PHYS_PAGE: 90; LOCATION: CR5U6; DRAWING: @RVP1_ADL_SB_ADP_S_DDR5_SODIMM_2DPC_LIB.H55_DG2_2DPC(SCH_1):PAGE461; CDS_LIB: discrete_2; VARIANT: ?; PCB Footprint: TK0_SOD962_600X300_MA; ROT: 1; CHIPS_PART_NAME: DIODE_ESD_BIDIR_2; CDS_PART_NAME: DIODE_ESD_BIDIR_2_SOD962-J24007-001,DIO,15KV,7A,TK0,GENERIC; CDS_LOCATION: CR5U6; ASI_MODEL: J24007-001
CR9001 = C_DIODE_TVS: CDS_PHYS_PART_NAME: C_DIODE_TVS_SM-J22733-001,DIO,ESD200-B1-CSP0201,3A,TK2,GENERIC; CDS_LMAN_SYM_OUTLINE: -100,50,100,-50; FP_TECH: TK2; IP: GENERIC; PACK_TYPE: SM; ROOM: NONE; OriginalSymbolOrigin: (-125,50); XY: (-3575,3750); VER: 1; PHYS_PAGE: 90; LOCATION: CR9001; DRAWING: @RVP1_ADL_SB_ADP_S_DDR5_SODIMM_2DPC_LIB.H55_DG2_2DPC(SCH_1):PAGE461; CDS_LIB: local; VARIANT: ?; PCB Footprint: CTK2_SCR0201_610X310_MA; ROT: 1; CHIPS_PART_NAME: C_DIODE_TVS; CDS_PART_NAME: C_DIODE_TVS_SM-J22733-001,DIO,ESD200-B1-CSP0201,3A,TK2,GENERIC; CDS_LOCATION: CR9001
FB9001 = C_FERRITE: CDS_PHYS_PART_NAME: C_FERRITE_0603-693286-060,FB,120,25%,3A,TK2,GENERIC; CDS_LMAN_SYM_OUTLINE: -50,50,50,-50; FP_TECH: TK2; IP: GENERIC; ROOM: NONE; OriginalSymbolOrigin: (-75,50); XY: (-2475,4025); VER: 1; ROT: 0; PHYS_PAGE: 90; LOCATION: FB9001; DRAWING: @RVP1_ADL_SB_ADP_S_DDR5_SODIMM_2DPC_LIB.H55_DG2_2DPC(SCH_1):PAGE461; CDS_LIB: c_discrete; VARIANT: ?; PCB Footprint: CTK2_SM0603_1750X950_MA; CHIPS_PART_NAME: C_FERRITE; CDS_PART_NAME: C_FERRITE_0603-693286-060,FB,120,25%,3A,TK2,GENERIC; CDS_LOCATION: FB9001
J5G2 = C_USB3_TYPE_A_9P_4EM: CDS_PHYS_PART_NAME: C_USB3_TYPE_A_9P_4EM_TH-K60322-001,CON,USB3P1_GEN2_9P_4EM,TK0,GA; CDS_LMAN_SYM_OUTLINE: -400,300,400,-300; FP_TECH: TK0; IP: GENERIC; PACK_TYPE: TH; ROOM: NONE; OriginalSymbolOrigin: (-425,300); XY: (-4350,3825); VER: 1; ROT: 0; PHYS_PAGE: 90; LOCATION: J5G2; DRAWING: @RVP1_ADL_SB_ADP_S_DDR5_SODIMM_2DPC_LIB.H55_DG2_2DPC(SCH_1):PAGE461; CDS_LIB: local; VARIANT: ?; PCB Footprint: CUSB3_MIDJR_9P_4EM_2000_MA_PIP_MR; SEC_TYPE: TH; CHIPS_PART_NAME: C_USB3_TYPE_A_9P_4EM; CDS_PART_NAME: C_USB3_TYPE_A_9P_4EM_TH-K60322-001,CON,USB3P1_GEN2_9P_4EM,TK0,GA; CDS_LOCATION: J5G2
L5U1 = CHOKE_4P: CDS_PHYS_PART_NAME: CHOKE_4P_SM3-J16541-001,CHOKE,90OHM,NA,100MA,LPDB,GENERIC; CDS_LMAN_SYM_OUTLINE: -150,200,150,-150; PACK_TYPE: SM3; TOLERANCE: NA; OriginalSymbolOrigin: (-175,200); XY: (-8500,4100); VER: 10; ROT: 7; PHYS_PAGE: 90; LOCATION: L5U1; IP: GENERIC; FP_TECH: LPDB; DRAWING: @RVP1_ADL_SB_ADP_S_DDR5_SODIMM_2DPC_LIB.H55_DG2_2DPC(SCH_1):PAGE461; CDS_LIB: discrete; PCB Footprint: SMI4_50X65MA; SEC_TYPE: SM3; CHIPS_PART_NAME: CHOKE_4P; CDS_PART_NAME: CHOKE_4P_SM3-J16541-001,CHOKE,90OHM,NA,100MA,LPDB,GENERIC; CDS_LOCATION: L5U1; ASI_MODEL: J16541-001
L5U2 = IND_4PIN: PART_NUMBER: 752402-015; CDS_PHYS_PART_NAME: IND_4PIN_0805-752402-015,CHOKE,90OHM,NA,0.4A,LPDB,GENERIC; CDS_LMAN_SYM_OUTLINE: -200,150,150,-150; PACK_TYPE: 0805; TOLERANCE: NA; OriginalSymbolOrigin: (-225,150); XY: (-8410,1125); VER: 2; ROT: 4; PHYS_PAGE: 90; LOCATION: L5U2; IP: GENERIC; FP_TECH: LPDB; DRAWING: @RVP1_ADL_SB_ADP_S_DDR5_SODIMM_2DPC_LIB.H55_DG2_2DPC(SCH_1):PAGE461; CDS_LIB: discrete; PCB Footprint: SMI4_79X47IA; SEC_TYPE: 0805; CHIPS_PART_NAME: IND_4PIN; CDS_PART_NAME: IND_4PIN_0805-752402-015,CHOKE,90OHM,NA,0.4A,LPDB,GENERIC; CDS_LOCATION: L5U2; ASI_MODEL: 752402-015
R5U3 = RES#1: PART_NUMBER: C80792-009; CHIPS_PART_NAME: RES; CDS_PHYS_PART_NAME: RES_0201-C80792-009,EMPTY,0,5%,1/20W,LPDB,GENERIC; TOLERANCE: 5%; WATTAGE: 1/20W; OriginalSymbolOrigin: (-75,25); XY: (-8475,4425); VER: 1; ROT: 2; PHYS_PAGE: 90; LOCATION: R5U3; IP: GENERIC; FP_TECH: LPDB; FIN: USB_BPR; DRAWING: @RVP1_ADL_SB_ADP_S_DDR5_SODIMM_2DPC_LIB.H55_DG2_2DPC(SCH_1):PAGE461; CDS_LIB: discrete; PCB Footprint: SMR0201IA; SEC_TYPE: 0201; CDS_PART_NAME: RES_0201-C80792-009,EMPTY,0,5%,1/20W,LPDB,GENERIC; CDS_LOCATION: R5U3; ASI_MODEL: C80792-009
R5U4 = RES#1: PART_NUMBER: C80792-009; CHIPS_PART_NAME: RES; CDS_PHYS_PART_NAME: RES_0201-C80792-009,EMPTY,0,5%,1/20W,LPDB,GENERIC; TOLERANCE: 5%; WATTAGE: 1/20W; OriginalSymbolOrigin: (-75,25); XY: (-8475,3725); VER: 1; PHYS_PAGE: 90; LOCATION: R5U4; IP: GENERIC; FP_TECH: LPDB; FIN: USB_BPR; DRAWING: @RVP1_ADL_SB_ADP_S_DDR5_SODIMM_2DPC_LIB.H55_DG2_2DPC(SCH_1):PAGE461; CDS_LIB: discrete; PCB Footprint: SMR0201IA; SEC_TYPE: 0201; ROT: 0; CDS_PART_NAME: RES_0201-C80792-009,EMPTY,0,5%,1/20W,LPDB,GENERIC; CDS_LOCATION: R5U4; ASI_MODEL: C80792-009
R5U5 = RES#1: PART_NUMBER: A93552-004; CHIPS_PART_NAME: RES; CDS_PHYS_PART_NAME: RES_0603-A93552-004,EMPTY,0,5%,1/10W,LPDB,GENERIC; WATTAGE: 1/10W; OriginalSymbolOrigin: (-75,25); XY: (-8385,725); VER: 1; PHYS_PAGE: 90; LOCATION: R5U5; IP: GENERIC; FP_TECH: LPDB; FIN: USB_BPR; DRAWING: @RVP1_ADL_SB_ADP_S_DDR5_SODIMM_2DPC_LIB.H55_DG2_2DPC(SCH_1):PAGE461; CDS_LIB: discrete; BOM: BP_USB_DUAL; PCB Footprint: SMR0603IA; SEC_TYPE: 0603; ROT: 0; CDS_PART_NAME: RES_0603-A93552-004,EMPTY,0,5%,1/10W,LPDB,GENERIC; CDS_LOCATION: R5U5; ASI_MODEL: A93552-004
R5U8 = RES#1: PART_NUMBER: A93552-004; CHIPS_PART_NAME: RES; CDS_PHYS_PART_NAME: RES_0603-A93552-004,EMPTY,0,5%,1/10W,LPDB,GENERIC; WATTAGE: 1/10W; OriginalSymbolOrigin: (-75,25); XY: (-8385,1475); VER: 1; PHYS_PAGE: 90; LOCATION: R5U8; IP: GENERIC; FP_TECH: LPDB; FIN: USB_BPR; DRAWING: @RVP1_ADL_SB_ADP_S_DDR5_SODIMM_2DPC_LIB.H55_DG2_2DPC(SCH_1):PAGE461; CDS_LIB: discrete; BOM: BP_USB_DUAL; PCB Footprint: SMR0603IA; ROT: 0; CDS_PART_NAME: RES_0603-A93552-004,EMPTY,0,5%,1/10W,LPDB,GENERIC; CDS_LOCATION: R5U8; ASI_MODEL: A93552-004
R9101 = RES#1: PART_NUMBER: A93549-001; CHIPS_PART_NAME: RES; CDS_PHYS_PART_NAME: RES_0402-A93549-001,EMPTY,0,5%,1/16W,LPDB,GENERIC; WATTAGE: 1/16W; OriginalSymbolOrigin: (-75,25); XY: (-8025,2925); VER: 1; PHYS_PAGE: 90; LOCATION: R9101; IP: GENERIC; FP_TECH: LPDB; FIN: LAN; DRAWING: @RVP1_ADL_SB_ADP_S_DDR5_SODIMM_2DPC_LIB.H55_DG2_2DPC(SCH_1):PAGE461; CDS_LIB: discrete; PCB Footprint: SMR0402IA; ROT: 0; CDS_PART_NAME: RES_0402-A93549-001,EMPTY,0,5%,1/16W,LPDB,GENERIC; CDS_LOCATION: R9101; BOM: LAN; ASI_MODEL: A93549-001
R9102 = RES#1: PART_NUMBER: A93549-001; CHIPS_PART_NAME: RES; CDS_PHYS_PART_NAME: RES_0402-A93549-001,EMPTY,0,5%,1/16W,LPDB,GENERIC; WATTAGE: 1/16W; OriginalSymbolOrigin: (-75,25); XY: (-8000,2700); VER: 1; PHYS_PAGE: 90; LOCATION: R9102; IP: GENERIC; FP_TECH: LPDB; FIN: LAN; DRAWING: @RVP1_ADL_SB_ADP_S_DDR5_SODIMM_2DPC_LIB.H55_DG2_2DPC(SCH_1):PAGE461; CDS_LIB: discrete; PCB Footprint: SMR0402IA; ROT: 0; CDS_PART_NAME: RES_0402-A93549-001,EMPTY,0,5%,1/16W,LPDB,GENERIC; CDS_LOCATION: R9102; BOM: LAN; ASI_MODEL: A93549-001
R9103 = RES#1: PART_NUMBER: A93549-001; CHIPS_PART_NAME: RES; CDS_PHYS_PART_NAME: RES_0402-A93549-001,CHIP,0,5%,1/16W,LPDB,GENERIC; WATTAGE: 1/16W; OriginalSymbolOrigin: (-75,25); XY: (-5800,4025); VER: 1; PHYS_PAGE: 90; LOCATION: R9103; IP: GENERIC; FP_TECH: LPDB; FIN: LAN; DRAWING: @RVP1_ADL_SB_ADP_S_DDR5_SODIMM_2DPC_LIB.H55_DG2_2DPC(SCH_1):PAGE461; CDS_LIB: discrete; PCB Footprint: SMR0402IA; ROT: 0; CDS_PART_NAME: RES_0402-A93549-001,CHIP,0,5%,1/16W,LPDB,GENERIC; CDS_LOCATION: R9103; BOM: LAN; ASI_MODEL: A93549-001
R9104 = RES#1: PART_NUMBER: A93549-001; CHIPS_PART_NAME: RES; CDS_PHYS_PART_NAME: RES_0402-A93549-001,CHIP,0,5%,1/16W,LPDB,GENERIC; WATTAGE: 1/16W; OriginalSymbolOrigin: (-75,25); XY: (-5800,3975); VER: 1; PHYS_PAGE: 90; LOCATION: R9104; IP: GENERIC; FP_TECH: LPDB; FIN: LAN; DRAWING: @RVP1_ADL_SB_ADP_S_DDR5_SODIMM_2DPC_LIB.H55_DG2_2DPC(SCH_1):PAGE461; CDS_LIB: discrete; PCB Footprint: SMR0402IA; ROT: 0; CDS_PART_NAME: RES_0402-A93549-001,CHIP,0,5%,1/16W,LPDB,GENERIC; CDS_LOCATION: R9104; BOM: LAN; ASI_MODEL: A93549-001